# EAGLE board imix (EAGLE 7.5.0), part 1 of 2
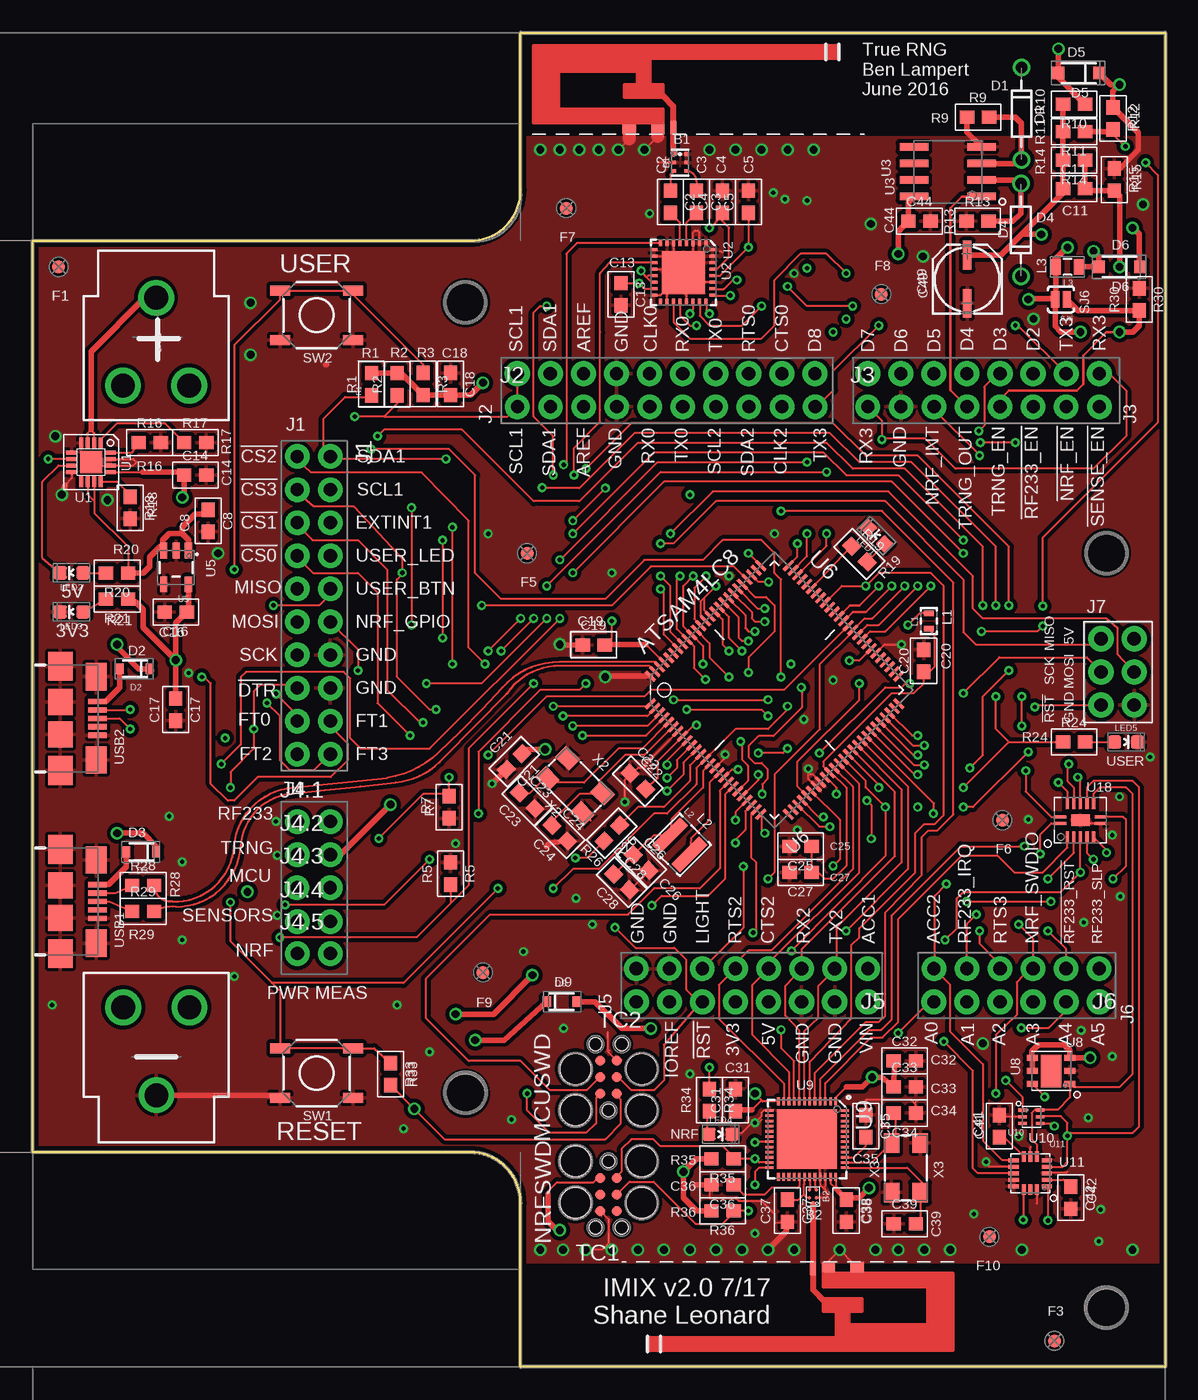
[diagram p8: board, top side]
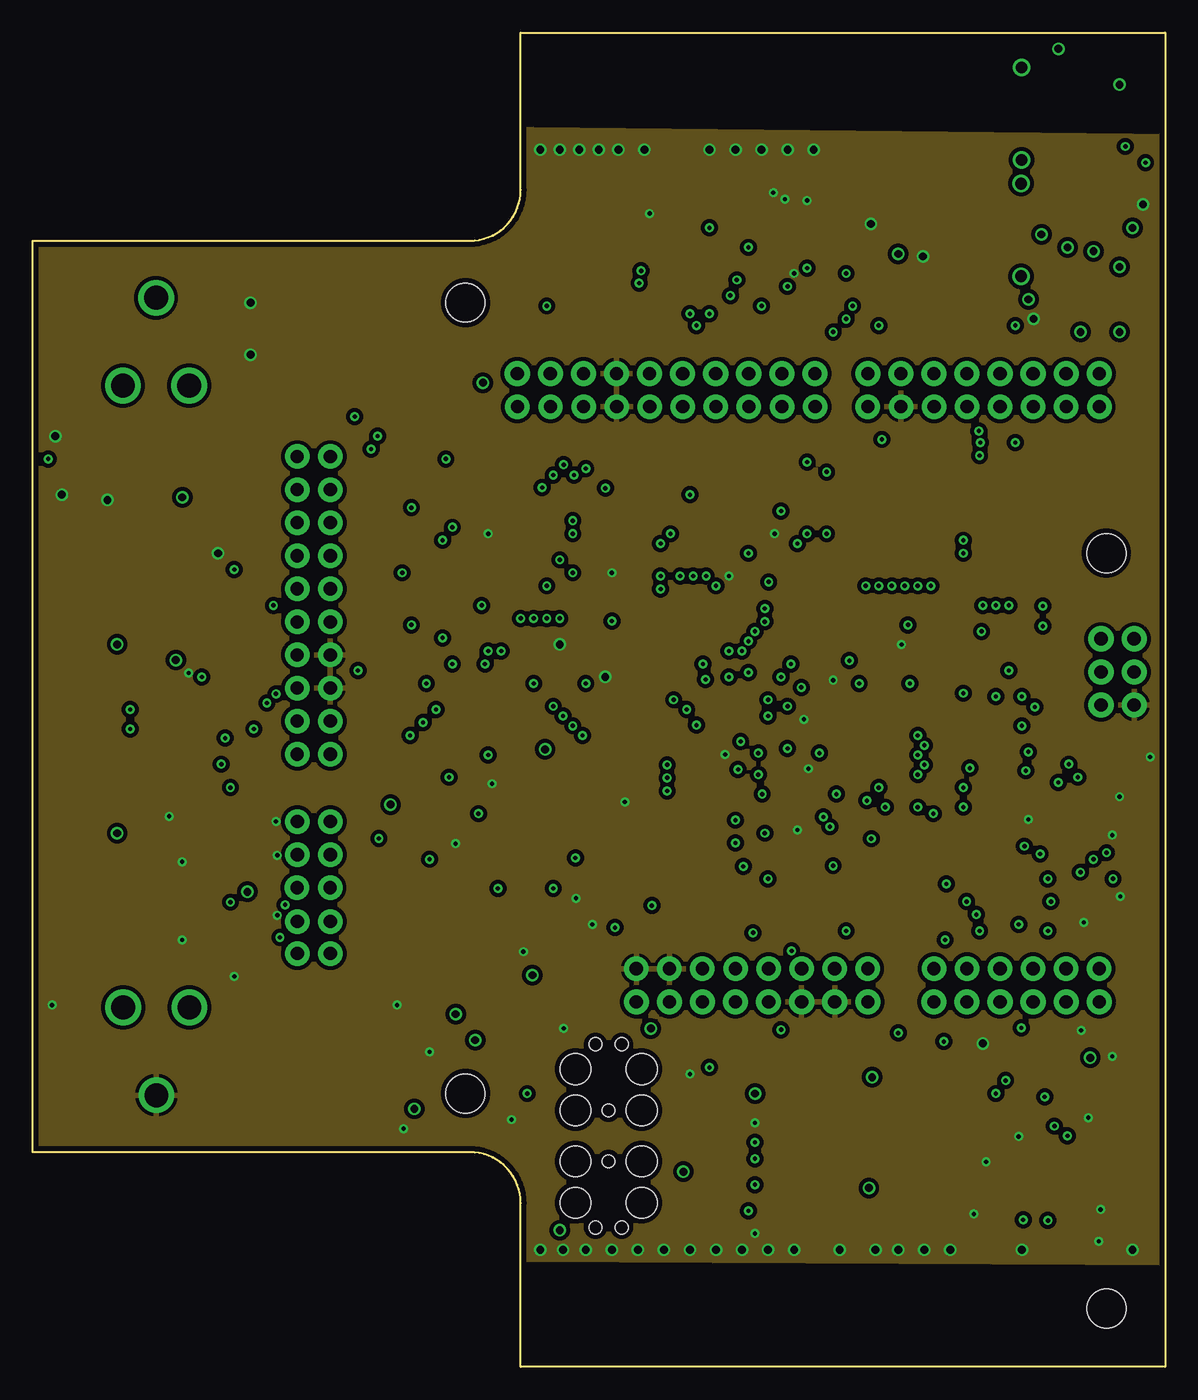
[diagram p9: board, inner layer Route2]
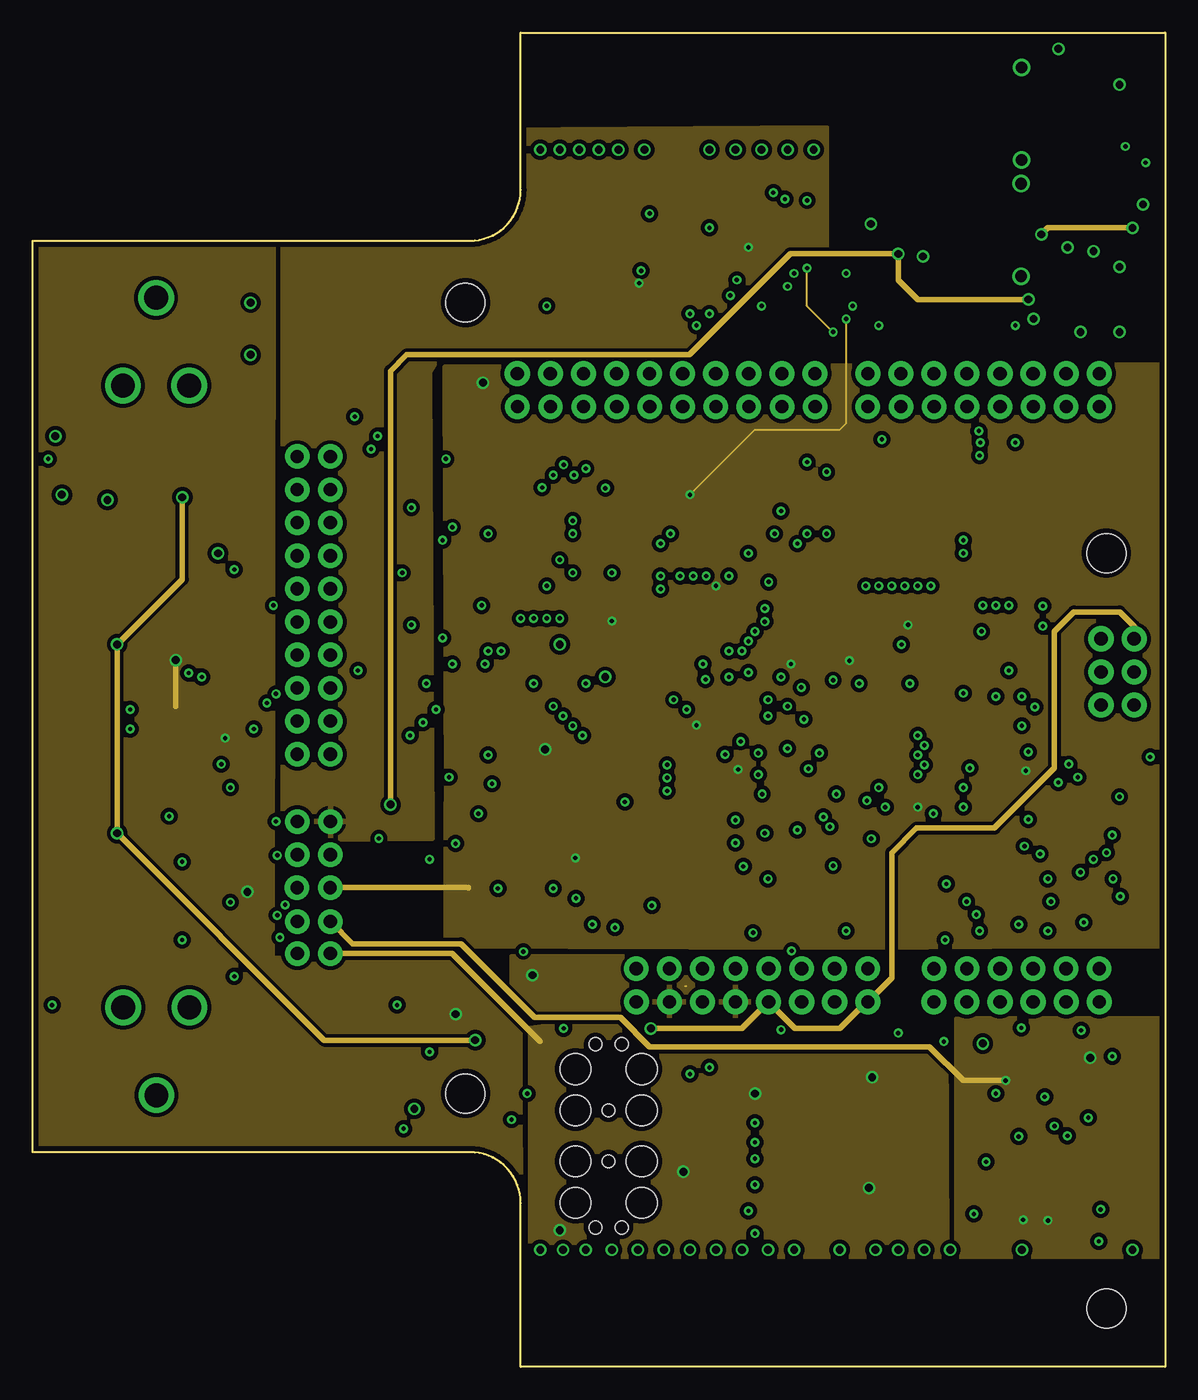
[diagram p10: board, inner layer Route15]
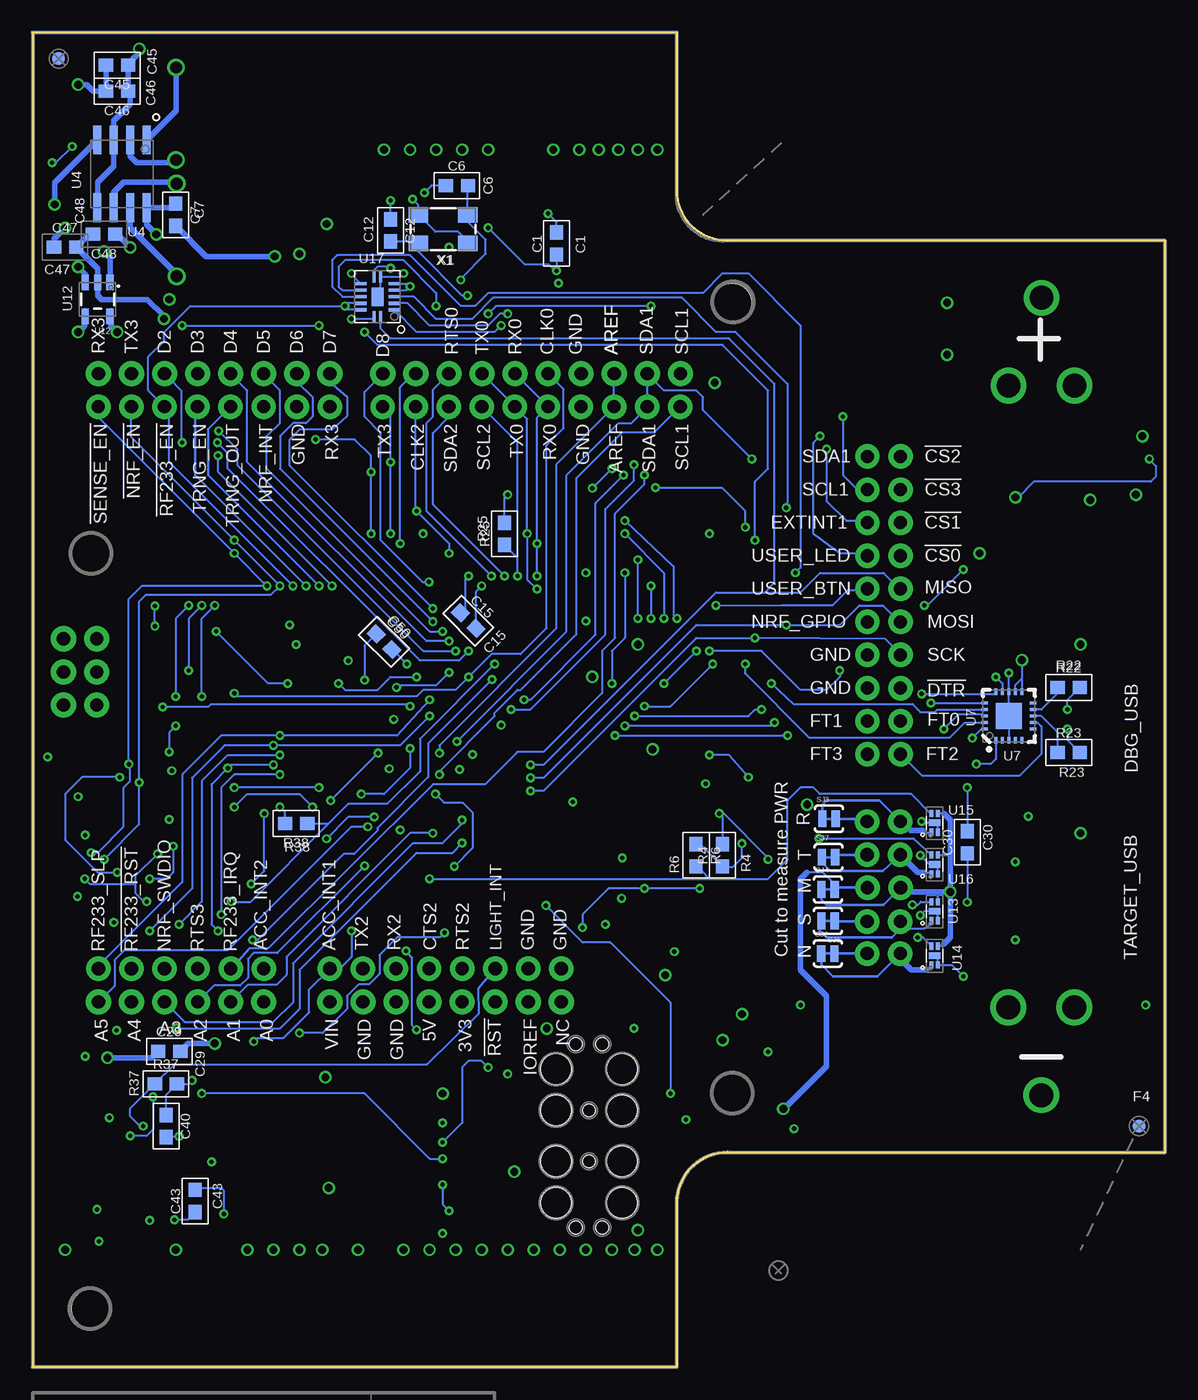
[diagram p11: board, bottom side, seen from below]

Size 87 x 102.5 mm. Coordinates in mm from the lower left corner, seen from the top.
Outline: 0,16.5 0,86.5 33.59,86.5 arc90 37.5,90.41 37.5,102.5 87,102.5 87,0 37.5,0 37.5,12.6 arc90 33.59,16.5 0,16.5
Copper layers (1+2*15+16): Top 0.0356mm / dielectric 9mil / Route2 0.0356mm / dielectric 40mil / Route15 0.0356mm / dielectric 9mil / Bottom 0.0356mm
Design rules "oshpark-2layer *": minimum track width 6mil, minimum drill 13mil, track to track 6mil, track to pad 6mil, pad to pad 6mil, via to via 6mil, smd to smd 6mil, copper to edge 15mil, drill to drill 6mil, minimum pad ring 7mil, minimum via ring 7mil, stop-mask expansion 2.5mil, vias tented up to drill 13mil, thermal gap 10mil
Net classes: 0 default: width 0.152 mm, drill 0.33 mm, clearance 0.152 mm; 1 power: width 0.152 mm, drill 0.33 mm, clearance 0.254 mm; 2 50ohm: width 0.152 mm, drill 0.33 mm, clearance 0.254 mm
Holes 3 mm at 33.25,81.75 33.25,21 82.5,4.5 82.5,62.5

## Footprints (pad centres in the part's own frame; a part is rotated, then mirrored left to right if it is on the bottom)
BALUN0805 = smd 0.3 x 0.3: 1 1.65,1.1; 2 1,1.1; 3 0.35,1.1; 4 0.35,0.15; 5 1,0.15; 6 1.65,0.15
BAL_NRF01D3 = smd 0.264 x 0.264: DIFF@1 0.219,0.25; DIFF@2 0.219,0.75; GND 0.819,0.75; SE 1.252,0.5; VCC 0.819,0.25
BATTERY_18650-HOLDER = drill 1.829: GND@1 30.628,0.01; GND@2 23.88,2.55; GND@3 23.88,-2.53; PWR@1 -30.628,-0.01; PWR@2 -23.88,2.53; PWR@3 -23.88,-2.55
C0603 = smd 1.1 x 1: 1 -0.85,0; 2 0.85,0
C0603-NOSILK = smd 1.1 x 1: 1 -0.85,0; 2 0.85,0
PANASONIC_C = smd 2.2 x 0.65: + 1.9,-0.2; - -1.8,-0.2
DIODE-ZENER = drill 0.9: P$1 -3.556,0; P$2 3.556,0
SOD-323 = smd 0.63 x 0.83: A 1.15,0; C -1.15,0
SOD-123 = smd 0.9 x 0.95: A 1.575,0; C -1.575,0
FIDUCIAL = smd 1 x 1: P$1 0,0
2X10_ROUND_NOSILK = drill 1.016 pad 1.88: 1 -11.43,-1.27; 2 -11.43,1.27; 3 -8.89,-1.27; 4 -8.89,1.27; 5 -6.35,-1.27; 6 -6.35,1.27; 7 -3.81,-1.27; 8 -3.81,1.27; 9 -1.27,-1.27; 10 -1.27,1.27; 11 1.27,-1.27; 12 1.27,1.27; 13 3.81,-1.27; 14 3.81,1.27; 15 6.35,-1.27; 16 6.35,1.27; 17 8.89,-1.27; 18 8.89,1.27; 19 11.43,-1.27; 20 11.43,1.27
1X10_NO_SILK = drill 1.016 pad 1.88: 1 0,0; 2 2.54,0; 3 5.08,0; 4 7.62,0; 5 10.16,0; 6 12.7,0; 7 15.24,0; 8 17.78,0; 9 20.32,0; 10 22.86,0
ARDUINO_R3_NO_HOLES = drill 1.016 pad 1.93: 3.3V 35.56,2.54; 5V 38.1,2.54; A0 50.8,2.54; A1 53.34,2.54; A2 55.88,2.54; A3 58.42,2.54; A4 60.96,2.54; A5 63.5,2.54; AREF 23.876,50.8; D0 63.5,50.8; D1 60.96,50.8; D2 58.42,50.8; D3 55.88,50.8; D4 53.34,50.8; D5 50.8,50.8; D6 48.26,50.8; D7 45.72,50.8; D8 41.656,50.8; D9 39.116,50.8; D10 36.576,50.8; D11 34.036,50.8; D12 31.496,50.8; D13 28.956,50.8; GND@1 40.64,2.54; GND@2 43.18,2.54; GND@3 26.416,50.8; GND@4 66.18,25.35; IOREF 30.48,2.54; MISO 63.64,30.43; MOSI 66.18,27.89; NC 27.94,2.54; RESET@1 33.02,2.54; RESET@2 63.64,25.35; SCK 63.64,27.89; SCL 18.796,50.8; SDA 21.336,50.8; VCC 66.18,30.43; VIN 45.72,2.54
1X08_NO_SILK = drill 1.016 pad 1.88: 1 0,0; 2 2.54,0; 3 5.08,0; 4 7.62,0; 5 10.16,0; 6 12.7,0; 7 15.24,0; 8 17.78,0
1X02_NO_SILK = drill 1.016 pad 1.88: 1 0,0; 2 2.54,0
1X06_NO_SILK = drill 1.016 pad 1.88: 1 0,0; 2 2.54,0; 3 5.08,0; 4 7.62,0; 5 10.16,0; 6 12.7,0
L0603 = smd 0.4 x 0.8: 1 0.2,0.4; 2 1.4,0.4
L1212 = smd 0.9 x 3: 1 -1.05,0; 2 1.05,0
0805 = smd 0.8 x 1.2: 1 -0.9,0; 2 0.9,0
LED-0603 = smd 1 x 1: A 0,-0.877; C 0,0.877
0603-RES = smd 1.1 x 1: 1 -0.85,0; 2 0.85,0
PAD-JUMPER-2-NC_BY_TRACE_YES_SILK = smd 0.635 x 1.27: 1 -0.508,0; 2 0.508,0
SJ_2S-NO = smd 0.635 x 1.27: 1 -0.45,0; 2 0.45,0
TACTILE-SWITCH-SMD = smd 1.524 x 0.762: 1 -2.794,1.905; 2 2.794,1.905; 3 -2.794,-1.905; 4 2.794,-1.905
TC2030-IDC = smd 0.787 x 0.787: 1 -1.27,-0.635; 2 -1.27,0.635; 3 0,-0.635; 4 0,0.635; 5 1.27,-0.635; 6 1.27,0.635 | hole 0.991: -2.54,0; 2.54,1.016; 2.54,-1.016 | hole 2.375: -2.54,2.54; -2.54,-2.54; 0.635,2.54; 0.635,-2.54
QFP16_3X3 = smd 0.85 x 0.3: 1 -1.475,0.75; 2 -1.475,0.25; 3 -1.475,-0.25; 4 -1.475,-0.75; 9 1.475,-0.75; 10 1.475,-0.25; 11 1.475,0.25; 12 1.475,0.75 | smd 0.3 x 0.85: 5 -0.75,-1.475; 6 -0.25,-1.475; 7 0.25,-1.475; 8 0.75,-1.475; 13 0.75,1.475; 14 0.25,1.475; 15 -0.25,1.475; 16 -0.75,1.475 | smd 1.7 x 1.7: PAD 0,0
32QN2 = smd 0.5 x 0.23: 1 -2.25,1.75; 2 -2.25,1.25; 3 -2.25,0.75; 4 -2.25,0.25; 5 -2.25,-0.25; 6 -2.25,-0.75; 7 -2.25,-1.25; 8 -2.25,-1.75; 17 2.25,-1.75; 18 2.25,-1.25; 19 2.25,-0.75; 20 2.25,-0.25; 21 2.25,0.25; 22 2.25,0.75; 23 2.25,1.25; 24 2.25,1.75 | smd 0.23 x 0.5: 9 -1.75,-2.25; 10 -1.25,-2.25; 11 -0.75,-2.25; 12 -0.25,-2.25; 13 0.25,-2.25; 14 0.75,-2.25; 15 1.25,-2.25; 16 1.75,-2.25; 25 1.75,2.25; 26 1.25,2.25; 27 0.75,2.25; 28 0.25,2.25; 29 -0.25,2.25; 30 -0.75,2.25; 31 -1.25,2.25; 32 -1.75,2.25 | smd 3.3 x 3.3: PADDLE 0,0
SO8 = smd 0.6 x 2.2: 1 -1.905,-2.6; 2 -0.635,-2.6; 3 0.635,-2.6; 4 1.905,-2.6; 5 1.905,2.6; 6 0.635,2.6; 7 -0.635,2.6; 8 -1.905,2.6
SOT23-5 = smd 0.55 x 1.2: 1 -0.95,-1.3; 2 0,-1.3; 3 0.95,-1.3; 4 0.95,1.3; 5 -0.95,1.3
TQFP100 = smd 1 x 0.25: 1 -7.5,6; 2 -7.5,5.5; 3 -7.5,5; 4 -7.5,4.5; 5 -7.5,4; 6 -7.5,3.5; 7 -7.5,3; 8 -7.5,2.5; 9 -7.5,2; 10 -7.5,1.5; 11 -7.5,1; 12 -7.5,0.5; 13 -7.5,0; 14 -7.5,-0.5; 15 -7.5,-1; 16 -7.5,-1.5; 17 -7.5,-2; 18 -7.5,-2.5; 19 -7.5,-3; 20 -7.5,-3.5; 21 -7.5,-4; 22 -7.5,-4.5; 23 -7.5,-5; 24 -7.5,-5.5; 25 -7.5,-6; 51 7.5,-6; 52 7.5,-5.5; 53 7.5,-5; 54 7.5,-4.5; 55 7.5,-4; 56 7.5,-3.5; 57 7.5,-3; 58 7.5,-2.5; 59 7.5,-2; 60 7.5,-1.5; 61 7.5,-1; 62 7.5,-0.5; 63 7.5,0; 64 7.5,0.5; 65 7.5,1; 66 7.5,1.5; 67 7.5,2; 68 7.5,2.5; 69 7.5,3; 70 7.5,3.5; 71 7.5,4; 72 7.5,4.5; 73 7.5,5; 74 7.5,5.5; 75 7.5,6 | smd 0.25 x 1: 26 -6,-7.5; 27 -5.5,-7.5; 28 -5,-7.5; 29 -4.5,-7.5; 30 -4,-7.5; 31 -3.5,-7.5; 32 -3,-7.5; 33 -2.5,-7.5; 34 -2,-7.5; 35 -1.5,-7.5; 36 -1,-7.5; 37 -0.5,-7.5; 38 0,-7.5; 39 0.5,-7.5; 40 1,-7.5; 41 1.5,-7.5; 42 2,-7.5; 43 2.5,-7.5; 44 3,-7.5; 45 3.5,-7.5; 46 4,-7.5; 47 4.5,-7.5; 48 5,-7.5; 49 5.5,-7.5; 50 6,-7.5; 76 6,7.5; 77 5.5,7.5; 78 5,7.5; 79 4.5,7.5; 80 4,7.5; 81 3.5,7.5; 82 3,7.5; 83 2.5,7.5; 84 2,7.5; 85 1.5,7.5; 86 1,7.5; 87 0.5,7.5; 88 0,7.5; 89 -0.5,7.5; 90 -1,7.5; 91 -1.5,7.5; 92 -2,7.5; 93 -2.5,7.5; 94 -3,7.5; 95 -3.5,7.5; 96 -4,7.5; 97 -4.5,7.5; 98 -5,7.5; 99 -5.5,7.5; 100 -6,7.5
QFN20 = smd 0.5 x 0.25: 1 -1.85,1; 2 -1.85,0.5; 3 -1.85,0; 4 -1.85,-0.5; 5 -1.85,-1; 11 1.85,-1; 12 1.85,-0.5; 13 1.85,0; 14 1.85,0.5; 15 1.85,1 | smd 0.25 x 0.5: 6 -1,-1.85; 7 -0.5,-1.85; 8 0,-1.85; 9 0.5,-1.85; 10 1,-1.85; 16 1,1.85; 17 0.5,1.85; 18 0,1.85; 19 -0.5,1.85; 20 -1,1.85 | smd 2 x 2: PADDLE 0,0
SI7021 = smd 0.85 x 0.45: 1 -1.45,1; 2 -1.45,0; 3 -1.45,-1; 4 1.45,-1; 5 1.45,0; 6 1.45,1 | smd 1.6 x 2.5: P$7 0,0
QFN48_6X6 = smd 0.6 x 0.2: 1 -2.9,2.2; 2 -2.9,1.8; 3 -2.9,1.4; 4 -2.9,1; 5 -2.9,0.6; 6 -2.9,0.2; 7 -2.9,-0.2; 8 -2.9,-0.6; 9 -2.9,-1; 10 -2.9,-1.4; 11 -2.9,-1.8; 12 -2.9,-2.2; 25 2.9,-2.2; 26 2.9,-1.8; 27 2.9,-1.4; 28 2.9,-1; 29 2.9,-0.6; 30 2.9,-0.2; 31 2.9,0.2; 32 2.9,0.6; 33 2.9,1; 34 2.9,1.4; 35 2.9,1.8; 36 2.9,2.2 | smd 0.2 x 0.6: 13 -2.2,-2.9; 14 -1.8,-2.9; 15 -1.4,-2.9; 16 -1,-2.9; 17 -0.6,-2.9; 18 -0.2,-2.9; 19 0.2,-2.9; 20 0.6,-2.9; 21 1,-2.9; 22 1.4,-2.9; 23 1.8,-2.9; 24 2.2,-2.9; 37 2.2,2.9; 38 1.8,2.9; 39 1.4,2.9; 40 1,2.9; 41 0.6,2.9; 42 0.2,2.9; 43 -0.2,2.9; 44 -0.6,2.9; 45 -1,2.9; 46 -1.4,2.9; 47 -1.8,2.9; 48 -2.2,2.9 | smd 4.6 x 4.6: PADDLE 0,0
ISL29035 = smd 0.65 x 0.25: 1 -0.675,0.5; 2 -0.675,0; 3 -0.675,-0.5; 4 0.675,-0.5; 5 0.675,0; 6 0.675,0.5
QFN16_3,5 = smd 0.8 x 0.3: 1 -1.275,1; 2 -1.275,0.5; 3 -1.275,0; 4 -1.275,-0.5; 5 -1.275,-1; 9 1.275,-1; 10 1.275,-0.5; 11 1.275,0; 12 1.275,0.5; 13 1.275,1 | smd 0.3 x 0.8: 6 -0.5,-1.275; 7 0,-1.275; 8 0.5,-1.275; 14 0.5,1.275; 15 0,1.275; 16 -0.5,1.275
TDFN4 = smd 0.3 x 0.55: 1 0.25,0.725; 2 -0.25,0.725; 3 -0.25,-0.725; 4 0.25,-0.725 | smd 0.86 x 0.5: PADDLE 0,0
DHVQFN14 = smd 0.9 x 0.24: 1 -1.55,-0.25; 7 1.55,-0.25; 8 1.55,0.25; 14 -1.55,0.25 | smd 0.24 x 0.9: 2 -1,-1.3; 3 -0.5,-1.3; 4 0,-1.3; 5 0.5,-1.3; 6 1,-1.3; 9 1,1.3; 10 0.5,1.3; 11 0,1.3; 12 -0.5,1.3; 13 -1,1.3 | smd 1.4 x 0.9: PADDLE 0,0
DN007-2 = smd 0.46 x 1: FEED 2.22,-2.8 | smd 1.01 x 0.74: GND -1.16,-2.93; GND@1 1.035,-2.93
USB-AB-MICRO-SMD = smd 1.4 x 0.4: D+ 2.85,0; D- 2.85,0.65; GND 2.85,-1.3; ID 2.85,-0.65; VBUS 2.85,1.3 | smd 1.9 x 2.2: SHIELD1 0,4; SHIELD4 0,-4 | smd 1.9 x 2: SHIELD2 0,1.25; SHIELD3 0,-1.25 | smd 1.6 x 2.1: SHIELD5 2.75,3.2; SHIELD6 2.75,-3.2
CTS_405_SERIES = smd 1.5 x 1.2: 1 -1.9,-1.1; 3 1.9,1.1; CASE@2 -1.9,1.1; CASE@4 1.9,-1.1

## Placement (x,y rotation side)
B1  2450BM15A0015  [BALUN0805]  50.37,91.52 90 top
B2  BAL_NRF01D3  [BAL_NRF01D3]  59.45,13.82 270 top
BAT1  [BATTERY_18650-HOLDER]  9.5,51.5 270 top
C1  100nF  [C0603]  46.73,86.29 90 bottom
C2  22pF  [C0603]  49,89.5 270 top
C3  22pF  [C0603]  51,89.5 270 top
C4  100nF  [C0603]  53,89.5 90 top
C5  1uF  [C0603]  55,89.5 90 top
C6  13pF  [C0603]  54.4,90.75 0 bottom
C7  0.47uF  [C0603]  76,88.5 270 bottom
C8  4.7uF  [C0603]  13.5,65 270 top
C11  22pF  [C0603]  80,90.5 0 top
C12  13pF  [C0603]  59.5,87.3 270 bottom
C13  1uF  [C0603]  45.2,82.4 270 top
C14  1uF  [C0603]  12.5,68.5 0 top
C15  100nF  [C0603]  53.53,57.33 315 bottom
C16  1uF  [C0603]  11,58 180 top
C17  100nF  [C0603]  11,50.5 270 top
C18  10uF  [C0603]  32.1,75.5 270 top
C19  100nF  [C0603]  43.1,55.47 0 top
C20  100nF  [C0603]  68.45,54.25 90 top
C21  100nF  [C0603]  37,46.5 225 top
C22  100nF  [C0603]  46.5,45 315 top
C23  13pF  [C0603]  38,43.5 315 top
C24  13pF  [C0603]  40.5,41 315 top
C25  4.7uF  [C0603]  59,40 180 top
C26  6.8uF  [C0603]  46.75,38.75 315 top
C27  100nF  [C0603]  59,38 180 top
C28  100nF  [C0603]  45.25,37.25 315 top
C29  100nF  [C0603]  76.5,24.25 0 bottom
C30  1uF  [C0603]  15.2,40.3 90 bottom
C31  100 nF  [C0603]  54,20.5 90 top
C32  100 nF  [C0603]  67,23.5 0 top
C33  100nF  [C0603]  67,21.5 0 top
C34  13pF  [C0603]  67,19.5 180 top
C35  1 nF  [C0603]  64,18.5 270 top
C36  47 nF  [C0603]  53,14 180 top
C37  2.2 nF  [C0603]  58,12 270 top
C38  1 nF  [C0603]  62.5,12 270 top
C39  13pF  [C0603]  67,11 0 top
C40  100nF  [C0603]  76.75,18.5 270 bottom
C41  100nF  [C0603]  74.25,18.5 90 top
C42  100nF  [C0603]  79.75,13 270 top
C43  100nF  [C0603]  74.5,12.75 90 bottom
C44  0.47uF  [C0603]  68.12,88.01 0 top
C45  DNP  [C0603]  80.5,100 180 bottom
C46  0.47uF  [C0603]  80.5,98 180 bottom
C47  0.47uF  [C0603-NOSILK]  84.5,86 0 bottom
C48  4.7uF  [C0603-NOSILK]  81.5,87 180 bottom
C49  10uF  [PANASONIC_C]  71.6,83.5 90 top
C50  100nF  [C0603]  59.99,55.71 315 bottom
D1  DIODE-ZENERPTH  [DIODE-ZENER]  75.97,96.27 270 top
D2  250mA/100V  [SOD-323]  7.86,53.63 180 top
D3  250mA/100V  [SOD-323]  8.36,39.56 180 top
D4  DIODE-ZENERPTH  [DIODE-ZENER]  75.93,87.34 90 top
D5  MBR0530  [SOD-123]  80.36,99.39 180 top
D6  MBR0530  [SOD-123]  83.5,84.5 180 top
D9  250mA/100V  [SOD-323]  40.65,28.06 0 top
F1  FIDUCIAL  [FIDUCIAL]  2,84.5 0 top
F2  FIDUCIAL  [FIDUCIAL]  85,100.5 0 bottom
F3  FIDUCIAL  [FIDUCIAL]  78.5,2 0 top
F4  FIDUCIAL  [FIDUCIAL]  2,18.5 0 bottom
F5  FIDUCIAL  [FIDUCIAL]  38,62.5 0 top
F6  FIDUCIAL  [FIDUCIAL]  74.5,42 0 top
F7  FIDUCIAL  [FIDUCIAL]  41,89 0 top
F8  FIDUCIAL  [FIDUCIAL]  65.2,82.4 0 top
F9  FIDUCIAL  [FIDUCIAL]  34.6,30.3 0 top
F10  FIDUCIAL  [FIDUCIAL]  73.5,10 0 top
J1  [2X10_ROUND_NOSILK]  21.6,58.5 270 top
J2  [1X10_NO_SILK]  37.25,73.76 0 top
J2_3_5_AND_6  ARDUINO_R3NO_HOLES  [ARDUINO_R3_NO_HOLES]  18.44,25.5 0 top
J3  [1X08_NO_SILK]  64.17,73.76 0 top
J4.1  [1X02_NO_SILK]  20.34,41.9 0 top
J4.2  [1X02_NO_SILK]  20.34,39.34 0 top
J4.3  [1X02_NO_SILK]  20.32,36.82 0 top
J4.4  [1X02_NO_SILK]  20.34,34.22 0 top
J4.5  [1X02_NO_SILK]  20.34,31.76 0 top
J5  [1X08_NO_SILK]  64.16,30.59 180 top
J6  [1X06_NO_SILK]  81.94,30.59 180 top
L1  BLM18HE152SN1  [L0603]  69.25,56.5 90 top
L2  22uH LQH3NPN220MJ0  [L1212]  49.72,40.11 315 top
L3  10uH  [0805]  79.5,84.5 180 top
LED1  [LED-0603]  64.82,63.84 45 top
LED2  [LED-0603]  3,61 90 top
LED3  [LED-0603]  3,58 90 top
LED4  [LED-0603]  52.85,17.88 270 top
LED5  [LED-0603]  84,48 270 top
R1  4.7K  [0603-RES]  26.03,75.49 90 top
R2  4.7K  [0603-RES]  27.99,75.49 90 top
R3  100K  [0603-RES]  30,75.5 270 top
R4  10K  [0603-RES]  34,39.3 90 bottom
R5  10K  [0603-RES]  32.1,37.9 270 top
R6  10K  [0603-RES]  36.02,39.3 270 bottom
R7  10K  [0603-RES]  32,43 90 top
R9  10K  [0603-RES]  72.63,96 0 top
R10  10K  [0603-RES]  80,97 180 top
R11  DNP  [0603-RES]  80,94.9 180 top
R12  DNP  [0603-RES]  83,95.9 270 top
R13  10K  [0603-RES]  72.6,88 0 top
R14  2.2M  [0603-RES]  80,92.7 180 top
R15  160K  [0603-RES]  83.1,91.2 270 top
R16  10K  [0603-RES]  9,71 0 top
R17  10K  [0603-RES]  12.5,71 0 top
R18  DNP  [0603-RES]  7.5,66 270 top
R19  1K  [0603-RES]  63.52,62.44 315 top
R20  1K  [0603-RES]  6.5,61 180 top
R21  1K  [0603-RES]  6.5,59 180 top
R22  27  [0603-RES]  7.4,52.2 0 bottom
R23  27  [0603-RES]  7.4,47.2 0 bottom
R24  1K  [0603-RES]  80,48 0 top
R25  4.7K  [0603-RES]  50.75,64 90 bottom
R26  10K  [0603-RES]  44.5,41 225 top
R28  27  [0603-RES]  8.5,37 0 top
R29  27  [0603-RES]  8.5,35 0 top
R30  10K  [0603-RES]  85,82 270 top
R33  DNP  [0603-RES]  27.5,22.5 270 top
R34  1K  [0603-RES]  52,20.5 270 top
R35  10K  [0603-RES]  53,16 180 top
R36  10K  [0603-RES]  53,12 180 top
R37  4.7K  [0603-RES]  76.75,21.75 0 bottom
R38  4.7K  [0603-RES]  66.75,41.75 180 bottom
SJ1  [PAD-JUMPER-2-NC_BY_TRACE_YES_SILK]  25.9,34.26 180 bottom
SJ2  [PAD-JUMPER-2-NC_BY_TRACE_YES_SILK]  25.91,31.76 0 bottom
SJ3  [PAD-JUMPER-2-NC_BY_TRACE_YES_SILK]  25.82,42.11 0 bottom
SJ4  [PAD-JUMPER-2-NC_BY_TRACE_YES_SILK]  25.89,36.68 0 bottom
SJ6  SOLDERJUMPERNO  [SJ_2S-NO]  79,82 180 top
SJ7  [PAD-JUMPER-2-NC_BY_TRACE_YES_SILK]  25.85,39.15 0 bottom
SW1  TAC_SWITCHSMD  [TACTILE-SWITCH-SMD]  21.82,22.57 180 top
SW2  TAC_SWITCHSMD  [TACTILE-SWITCH-SMD]  21.82,80.78 180 top
TC1  TC2030-IDC  [TC2030-IDC]  44.25,13.25 270 top
TC2  TC2030-IDC  [TC2030-IDC]  44.25,22.25 90 top
U1  BQ2423X  [QFP16_3X3]  4.5,69.5 270 top
U2  [32QN2]  50,84.07 270 top
U3  TLV3202  [SO8]  70.31,91.81 90 top
U4  LM358  [SO8]  80.14,91.64 180 bottom
U5  LDO-TPS78233  [SOT23-5]  11.03,61.41 180 top
U6  ATSAM4LCX_100  [TQFP100]  57,52 45 top
U7  [QFN20]  12,50 90 bottom
U8  SI7021  [SI7021]  78.25,22.73 180 top
U9  NRF51422  [QFN48_6X6]  59.5,17.5 270 top
U10  ISL29035  [ISL29035]  76.73,19.22 0 top
U11  FX0S8700CQ  [QFN16_3,5]  76.64,14.88 180 top
U12  296-12686-1-ND  [SOT23-5]  82,82 180 bottom
U13  SIP32401A  [TDFN4]  17.7,35 180 bottom
U14  SIP32401A  [TDFN4]  17.7,31.6 180 bottom
U15  SIP32401A  [TDFN4]  17.7,41.8 180 bottom
U16  SIP32401A  [TDFN4]  17.7,38.6 180 bottom
U17  74LVC4066BQ  [DHVQFN14]  60.5,82.2 90 bottom
U18  74LVC4066BQ  [DHVQFN14]  80.5,42 0 top
U$1  INVERTED_F_ANTENNA-2  [DN007-2]  47,98 0 top
U$4  INVERTED_F_ANTENNA-2  [DN007-2]  62.18,4.76 180 top
USB1  [USB-AB-MICRO-SMD]  2.14,35.75 0 top
USB2  [USB-AB-MICRO-SMD]  2.14,49.82 0 top
X1  16MHz  [CTS_405_SERIES]  55.45,87.4 180 bottom
X2  16MHz  [CTS_405_SERIES]  41.66,44.64 135 top
X3  16MHz  [CTS_405_SERIES]  67.09,15.3 90 top

## Tracks (layer width: path | path; a pad name or v marks a point on that pad's centre or on a via)
!RESET  (via drill 0.33)
  Top 0.152: v40,36.75 41.5,38.25 43.5,38.25 47.75,42.5 48.75,42.5 51,44.75 51,46 U6.13 54,49 56.5,49 58,50.5 v58,50.75 | v35.75,36.75 28.5,29.5 18.4,29.5 | 18.4,29.5 15.2,32.7 v15.2,35.7 | TC2.3 45,22.25 46,21.25 47.75,21.25 48.5,22 48.5,24.75 51.25,28 51.42,28 J2_3_5_AND_6.RESET@1 51.16,28.04 50.2,29 50.2,31.3 49.3,32.2 46.3,32.2 v44.75,33.75 | 18.4,29.5 19.03,28.87 SW1.4 SW1.3 26.24,24.48 R33.1 | v77,50.7 77.15,50.85 J2_3_5_AND_6.RESET@2
  Bottom 0.152: v35.75,36.75 v40,36.75 42.75,36.75 44.75,34.75 v44.75,33.75 | v58,50.75 58.15,50.9 73.3,50.9 73.5,50.7 v77,50.7 | C30.1 v15.2,35.7
ACC_INT1  (via drill 0.33)
  Top 0.152: U6.42 67.25,44.58 67.25,38.25 v62.5,33.5 | U11.11 72.61,14.88 72.25,15.25 72.25,22.75 v70,25
  Bottom 0.152: v62.5,33.5 62.5,31.5 63.41,30.59 J5.1 65.75,29 65.75,27.25 67.75,25.25 69.75,25.25 v70,25
ACC_INT2  (via drill 0.33)
  Top 0.152: U6.43 69.24,43.3 69.24,42.54 v69.2,42.5 | U11.9 74.5,15.88 73,17.39 73,23.25 70.5,25.75 70.5,29.33 J6.6 69.3,30.65 69.3,36.2 v70.2,37.1
  Bottom 0.152: v69.2,42.5 69.2,38.1 v70.2,37.1
ADCIFE0  (via drill 0.33)
  Top 0.152: U6.24 55.2,42.42 55.2,39.15 55.55,38.8 55.55,33.55 v55.35,33.35 | v66.5,25.65 68.85,28 69.2,28 J2_3_5_AND_6.A0
  Bottom 0.152: v66.5,25.65 64.7,25.65 62.85,27.5 62.85,28.5 61.95,29.4 61.15,29.4 60.35,30.2 60.35,31.65 58.95,33.05 55.65,33.05 v55.35,33.35
ADCIFE1  (via drill 0.33)
  Top 0.152: U6.25 56,42.38 56,41.25 v56.25,41
  Bottom 0.152: v56.25,41 58,41 67.5,31.5 67.5,30.1 68.25,29.35 70.47,29.35 J2_3_5_AND_6.A1
ADCIFE2  (via drill 0.33)
  Top 0.152: U6.31 62,42.05 62,39 v61.5,38.5
  Bottom 0.152: v61.5,38.5 68.2,31.8 70,31.8 70.45,31.35 70.45,29.9 71.05,29.3 73.06,29.3 J2_3_5_AND_6.A2
ADCIFE3  (via drill 0.33)
  Top 0.152: U6.22 54,42.64 v54,42
  Bottom 0.152: v54,42 54,41.75 55.5,40.25 57.75,40.25 67,31 67,28 68.5,26.5 75.32,26.5 J2_3_5_AND_6.A3
ADCIFE4  (via drill 0.33)
  Top 0.152: U6.23 54.75,42.68 54.75,41.25 54,40.5 v54,40.25 | v75.95,26.05 78.05,26.05 79.4,27.4 J2_3_5_AND_6.A4
  Bottom 0.152: v54,40.25 54.75,39.5 57.5,39.5 66.5,30.5 66.5,27.5 68,26 75.87,26 75.92,26.05 v75.95,26.05
ADCIFE5  (via drill 0.33)
  Top 0.152: U6.28 60.43,41.5 v61.25,41.5
  Bottom 0.152: v61.25,41.5 62.5,41.5 72,32 79.95,32 80.7,31.25 80.7,29.28 J2_3_5_AND_6.A5
AREF  (via drill 0.33)
  Top 0.152: U6.34 60.97,45.28 61.75,44.5 v61.75,44 | v58,47.5 57.65,47.15 v55.75,47.15
  Bottom 0.152: v58,47.5 58,46 60,44 v61.75,44 | J2_3_5_AND_6.AREF 42.33,76.29 J2.3 46.75,69.34 46.75,56.75 55.75,47.75 v55.75,47.15
BUCK/BOOST
  Top 0.152: U6.12 50.5,46.21 50.5,45 48.5,43 46.5,43 R26.1
DTR  (via drill 0.33)
  Top 0.152: J1.15 20.08,52.4 17.5,52.4 17,51.9 v17,49 17,47.5 15.2,45.7 v15.2,44.5
  Bottom 0.152: U7.18 13.9,50 14,50.1 15.9,50.1 v17,49 | v15.2,44.5 C30.2
EXTINT1  (via drill 0.33)
  Top 0.152: U6.30 58.75,44.59 58.75,46.5 63.5,51.25 v63.5,52.5 | v57.5,53 57.5,60.5 57,61 57,62.5 56,63.5 53,63.5 51.5,62 47,62 44,59 36,59 34,61 34,68.5 32,70.5 v26,70.5
  Bottom 0.152: v63.5,52.5 63,52 60.5,52 59.5,53 v57.5,53 | v26,70.5 26,66.5 24.5,65 23.02,65 J1.6
FTDI0  (via drill 0.33)
  Top 0.152: v18.7,51.7 20.3,50.1 20.3,49.7 J1.17
  Bottom 0.152: v18.7,51.7 13.1,51.7 13,51.8 U7.15
FTDI1  (via drill 0.33)
  Top 0.152: J1.18 22.9,49.6 22.9,49.2 24.2,47.9 24.2,46.6 22.9,45.3 17.3,45.3 15.5,43.5 15,43.5 13.7,44.8 13.7,52.5 13.2,53 v13,53
  Bottom 0.152: v13,53 12.5,52.5 U7.14
FTDI2
  Bottom 0.152: 20.33,46.99 J1.19 18.66,45.4 11.2,45.4 9.5,47.1 9.5,49.2 9.8,49.5 U7.7
FTDI3  (via drill 0.33)
  Top 0.152: v18,51 19,50 19,46.6 19.8,45.8 21.6,45.8 J1.20
  Bottom 0.152: v18,51 U7.16
GND  (via drill 0.33, 0.6)
  Top 0.152: U6.56 65.45,55.5 v66.75,55.5 | 42.88,41.94 X2.CASE@2 | 44.06,53.06 v44,53 | U9.PADDLE 60.5,16.5 U9.33 60.5,14 60.75,13.75 | 60.75,13.75 61,13.5 61,13 B2.GND | U2.PADDLE 49.75,84.32 49.5,84.32 48.5,85.32 U2.10 | U2.16 48.25,82.32 U2.PADDLE | U2.18 48.75,83.25 49.5,84 49.18,84.32 | 48.75,84.75 49.18,84.32 | U2.27 50.75,83.32 50.53,83.53 | 50.53,83.53 U2.PADDLE | U2.21 50.25,83.82 U2.PADDLE | 50.53,83.53 50.75,83.75 U2.3 50.75,87.15 50.9,87.3 51.1,87.3 51.2,87.2 51.2,86.37 U2.2 | 4.25,69.75 U1.PAD 4.75,69.25 U1.14 7.75,69.25 8,69.5 7.75,69.75 U1.15 | U2.12 49.18,84.32 | v42.5,9 43.75,9 44.25,9.5 44.25,11.34 TC1.5 | LED4.C 53.84,18 54.5,18 55.5,19 v55.5,18.75 | v55.5,18.75 55.5,18.5 56,19 | 64,19.75 C35.1 64,20.5 67.5,20.5 67.85,20.15 C34.1 | C36.2 52,13.85 52,13 54,13 54.25,12.75 56,12.75 57,11.75 57,11 57.06,11.07 C37.2 | U$4.GND@1 60.97,7.96 v62,9 63.07,7.93 U$4.GND | U11.10 73.61,15.38 arc-90 v73.25,15.75 | 46,45.25 C22.1 | U6.7 47,46.24 47,46 46.5,46 45.5,45.1 v45.5,43.4 | v45,93.5 45.84,94.34 | v47,93.5 48.03,94.53 | C28.2 47.38,38.06 C26.2 | U2.PADDLE 50,84 49.25,84.75 U2.6 49.25,86.5 | 44.2,24.2 44.3,24.3 | TC2.5 44.2,24.2 | 44.2,24.2 44.2,25.7 | U9.34 60.9,13.9 60.75,13.75 | U9.13 56.2,19.7 56,19.5 56,19.25 v55.5,18.75 | 3,70.28 U1.5 | U1.8 3.02,68.28 2.5,67.75 | 67.85,20.35 68,20.5 | U2.31 52.42,85.32 | 52.8,85.7 52.9,85.7 53,85.6 | U6.33 59.96,45.5 59.65,45.5 59.6,45.45 | B1.2 48.02,92.52 | 79.5,15 79.4,14.9 77.9,14.9 | U10.2 74.38,19.22 C41.2 | U11.16 77.14,12.56 77.15,12.55 | U11.7 76.64,16.89 76.65,16.9 | U6.15 53.2,46.79 v53.2,47.05 | U6.32 59.6,45.16 59.6,45.45 | 59.6,45.45 v59.6,45.95 | 57.75,89.62 v57.8,89.7
  Top 0.152: U18.7 80.75,41.75 U18.PADDLE
  Top 0.406: U6.100 44.06,53.06 | C19.1 40.53,55.47 v40.5,55.5 | 2.5,67.75 v2.25,67 | C37.2 57.93,10.43 v56.5,9 | LED5.C 84.62,48.26 | C24.2 39.74,40.24 39.5,40 | C36.2 51,14 | 18.68,20.87 BAT1.GND@1 | 22.59,77 22.5,77 | R9.1 71.78,94.84 U3.4 | C21.2 v35.3,44.8 | 83.15,92.05 R15.1 83.5,92.05 84.95,93.5 84.95,94.8 R12.1 83,98 v83.5,98.5 82.83,98.5 D5.C
  Top 1: 45.84,94.34 U$1.GND | 48.03,94.53 U$1.GND@1
  Bottom 0.152: U7.3 U7.PADDLE U7.13 v12,53.3 | R6.1 35.62,40.07 R4.1 33.95,38.4 33.2,38.4 32.5,39.1 v32.5,40.2 | C43.2 74.35,13.75 72.5,13.75 72.31,13.56 v72.31,11.75 | C40.2 76.7,17.7 v75.75,17.7 | C15.1 53.75,58.31 53.75,60.5 v53.5,60.75 | C50.1 61.5,55.4 v61.5,52.75 | C12.1 v59.5,89.6 | X1.CASE@4 57.5,88.35 | X1.CASE@2 53.55,86.45 54.3,87.2 56.05,87.2 X1.CASE@4 | X1.CASE@4 57.35,89.25 v57.8,89.7 | C1.2 46.73,87.94 v47.4,88.6 | C6.1 56.35,90.75 v56.9,90.2 | v58.5,84 58.75,83.75 U17.7 60.25,82.45 U17.PADDLE | U15.2 17.45,41.8 U15.PADDLE 18.6,41.8 v18.7,41.9 | v18.8,39.3 18.1,38.6 U16.PADDLE 17.45,38.35 U16.2 | v18.8,34.7 18.5,35 U13.PADDLE 17.45,34.75 U13.2 | v15.5,30 16.38,30.88 U14.2 17.45,31.35 U14.PADDLE
  Bottom 0.406: C45.2 C46.2 82.35,98 82.85,98.5 v83.5,98.5 | U4.4 85.3,90.98 v85.3,89.3 | C7.2 73.65,85.3 v68.4,85.3 | C48.2 82.65,87 C47.2 82,84.35 U12.2 82,82.3 81.7,82 78.2,82 76.9,80.7 v76.9,80.5 | C29.2 75.05,24.85 v73,24.85
  other vias: 39,93.5 14.25,62.5 5.75,66.6 52,93.5 58,93.5 60,93.5 42,93.5 39,9 40.75,9 44.5,9 46.5,9 48.5,9 50.5,9 52.5,9 54.5,9 58.5,9 64.75,9 66.5,9 68.5,9 70.5,9 84.5,9 76,9 81.9,9.65 43,34 44.5,61 40.5,93.5 43.5,93.5 50.5,22.5 55.5,10.25 83.5,43.8 76.5,42.05 82.95,23.85 59.25,49.75 41.75,36 58.75,41.25 1.75,71.5 16.75,81.75 16.75,77.75 54,93.5 56,93.5 81.1,19.15 82.05,12.1 80.55,25.85 83.55,36.15 80.75,34.15 85.85,46.85 82.95,40.85 35,64 57,64 30.5,24.2 11.5,32.8 11.5,38.8 10.5,42.3 1.5,27.8 37.7,31.9 28.5,18.3 28,27.8 36.8,19 40.8,26 64.4,87.8
  pour Route2 (isolate 0.305): -4,95.5 -5,8.5 88,8 88,94.5
  pour Top (isolate 0.305): -12.5,94.5 95.8,94.5 95.5,8 -12.5,8
GPIO2  (via drill 0.33)
  Top 0.152: U6.86 53,57.41 53,55.5 v53.5,55 | v75.5,71 v72.8,71
  Bottom 0.152: J2_3_5_AND_6.D2 76.5,75.94 75.58,74.99 75.58,71.08 v75.5,71 | v53.5,55 54.25,54.25 57.25,54.25 72,69 72,70.2 v72.8,71
GPIO3  (via drill 0.33)
  Top 0.152: v54.5,55 53.5,56 53.5,57.62 U6.85 | J2_3_5_AND_6.D3 74.1,76.3 73.1,75.3 73.1,72.3 v72.7,71.9
  Bottom 0.152: v54.5,55 57,55 71.25,69.25 71.25,70.45 v72.7,71.9
GPIO4  (via drill 0.33)
  Top 0.152: v55,55.75 54.5,55.75 54.25,56 54.25,57.58 U6.84
  Bottom 0.152: J2_3_5_AND_6.D4 71.78,76.28 70.5,75 70.5,69.5 56.75,55.75 v55,55.75
GPIO5  (via drill 0.33)
  Top 0.152: U6.83 53.46,59.04 54.75,57.75 54.75,56.75 55,56.5 v55.5,56.5
  Bottom 0.152: J2_3_5_AND_6.D5 69.24,76.24 68,75 68,72.5 69,71.5 69,69 56.5,56.5 v55.5,56.5
GPIO6  (via drill 0.33)
  Top 0.152: 56,57.24 v56.25,57.25 55.5,57.25 55.25,57.5 55.25,57.99 U6.82
  Bottom 0.152: J2_3_5_AND_6.D6 66.7,75.7 65.5,74.5 65.5,73 66,72.5 67,72.5 68,71.5 68,69 v56.25,57.25
GPIO7  (via drill 0.33)
  Top 0.152: U6.81 55.7,58.25 v56.25,58.25
  Bottom 0.152: J2_3_5_AND_6.D7 64.16,75.66 62.85,74.53 62.85,73.03 64,72 66.5,72 67.25,71.25 67.25,69.25 v56.25,58.25
GPIO8  (via drill 0.33)
  Top 0.152: v56.55,60.3 55.77,60.3 U6.78
  Bottom 0.152: J2_3_5_AND_6.D8 61.5,74.9 61.5,73 60.25,71.75 60.25,63.5 57.05,60.3 v56.55,60.3
KERNEL_LED
  Top 0.152: U6.70 R19.1
LIGHT_!INT  (via drill 0.33)
  Top 0.152: U10.4 78.28,18.72 v78.5,18.5 | U6.80 55.51,59.15 56.35,59.15 57,58.5 57,56.5 55,54.5 v55,53.35 | v56.05,44 56.05,44.75 56.45,45.15 56.45,45.95 56,46.4 55.45,46.4 55,46.85 55,47.7 55.75,48.45 56.9,48.45 59.1,50.65 59.1,52.15 v59.05,52.2 | v54.6,38.45 54.6,33.73 J5.6
  Bottom 0.152: J5.6 52.72,29.08 52.71,27.16 56.7,23.25 76.1,23.25 R37.1 79.5,19.85 79.5,19.25 78.75,18.5 v78.5,18.5 | v55,53.35 55.95,52.4 58.85,52.4 v59.05,52.2 | v56.05,44 55.4,43.35 53.95,43.35 53.2,42.6 53.2,39.85 v54.6,38.45
MCU_VOUT3.3
  Top 0.152: U6.16 52,44.88 52,42 50.58,40.58 L2.2
MISO  (via drill 0.33)
  Top 0.152: U6.9 48.75,46.58 v48.75,46.25
  Bottom 0.152: v48.75,46.25 47.75,46.25 34.5,59.5 30.75,59.5 | 30.75,59.5 28,59.5 26.5,61 21.64,61 20.41,59.77 J1.9 | 30.75,59.5 30,60.25 30,75.5 33.5,79 59.5,79 60.25,79.75 U17.1
MOSI  (via drill 0.33)
  Top 0.152: v29.1,66 v29.1,57 | U6.10 49.5,46.62 49.5,46 v48.75,45.25
  Bottom 0.152: v48.75,45.25 47.75,45.25 36,57 v29.1,57 25,57 23.5,58.5 21.68,58.5 20.41,57.23 J1.11 | U17.4 57.7,82.2 56,80.5 53.25,80.5 51.62,82.12 37.12,82.12 34.5,79.5 33,79.5 29,75.5 29,66.1 v29.1,66
N$1
  Top 0.152: U2.5 49.75,87.9 C2.2
N$2  (via drill 0.33)
  Top 0.152: U2.29 52.57,84.32 53.5,85.25 53.5,87.5 53,88 C4.1 52.15,87.5 v52,87.5 | U2.14 47.53,83.32 47.18,83.72 | 47.18,83.72 v46.75,84.2 | U2.13 47.29,83.82 47.18,83.72
  Bottom 0.152: C1.1 46.75,85.42 v46.75,84.2 47.35,84.7 49.2,84.7 v52,87.5
N$3
  Top 0.152: USB1.D- 6.38,36.4 R28.1
N$4  (via drill 0.33)
  Top 0.152: U2.26 52.27,82.8 53.1,82.8 53.8,83.5 v54.1,83.5
  Bottom 0.152: v54.1,83.5 54.1,83.6 52.2,85.5 52.2,86.6 53.5,87.9 53.5,88.45 X1.1 53.6,88.5 53.6,90.15 C6.2
N$5
  Top 0.152: 59.95,7.97 U$4.FEED | 59.95,12.5 B2.SE
  Top 0.46: 59.95,12.5 U$4.FEED
N$6
  Top 0.152: B2.VCC 59.5,13 59.25,13.25 | 59.25,13.25 59.25,14 59.3,14.05 U9.30 | C37.1 58.85,12.85 59.25,13.25
N$7
  Top 0.152: U9.38 64.49,15.7 X3.3 66.29,17.5 66.29,19.36 C34.2
N$8
  Bottom 0.152: U13.1 17.95,34.05 18.5,33.7 19.82,33.7 J4.4.1
  Bottom 0.203: J4.4.1 20.34,33.66 21,33 26,33 26.5,33.5 26.5,34.26 SJ1.2
N$9
  Top 0.152: U9.37 67.2,15.3 68.5,14 68.5,13.71 X3.1 68.19,11.34 C39.2
N$10
  Top 0.152: C25.1 C27.1 60.35,38 60.85,37.5 61.5,37.5 62.5,38.5 62.5,44.5 61.36,45.64 U6.35 60.75,46.13 60.75,46.5 66,51.75 67.7,51.75 68.45,52.5 C20.1 68.9,53.4 69.3,53.8 69.3,56.2 L1.1
N$11
  Top 0.152: U6.6 49.17,49.17 47,47 45.5,47 43.5,45 43.5,43.95 | 43.5,43.95 X2.1 | 43.5,43.95 43.45,44 42,44 39.95,41.95 C24.1
N$12
  Top 0.152: U6.14 51.5,45.79 51.5,44.5 49.09,42.09 L2.1 | C28.1 46.17,39.26 C26.1 47.75,40.85 L2.1 | 48.25,40.85 L2.1
N$13
  Top 0.152: U6.5 46.84,47.5 45,47.5 42.38,44.88 39.87,44.88 X2.3 39.33,45.21 38.23,44.1 C23.1
N$14
  Top 0.152: R19.2 LED1.A
N$15
  Top 0.152: U9.39 63.1,16.1 64,17 C35.2
N$17
  Top 0.152: U2.4 50.25,87.9 C3.2
N$18
  Bottom 0.152: 18.32,30.5 U14.1
  Bottom 0.203: J4.5.1 22.1,30 25.5,30 26.42,30.92 SJ2.1
  Bottom 0.406: J4.5.1 20.34,31.34 19.5,30.5 18.32,30.5
N$19
  Top 0.152: U9.29 58.9,13.9 58.75,13.75 56.75,13.75 56.25,13.25 54.6,13.25 C36.1 53.5,13.62
N$20  (via drill 0.33)
  Top 0.152: USB2.D- 7.47,50.47 v7.5,50.5
  Bottom 0.152: v7.5,50.5 7.5,51.25 R22.2
N$21
  Top 0.152: U9.31 B2.DIFF@1
N$22
  Top 0.152: B1.3 49,91.6 C2.1
N$23
  Top 0.152: U9.32 60.1,13.7 B2.DIFF@2
N$24
  Bottom 0.152: R22.1 8.25,51.75 9.5,50.5 U7.9
N$26  (via drill 0.33)
  Top 0.152: USB2.D+ 6.68,49.82 v7.5,49
  Bottom 0.152: v7.5,49 7.5,48.15 R23.2
N$29
  Top 0.152: R24.2 LED5.A
N$30
  Bottom 0.152: R23.1 8.25,48.75 9.5,50 U7.8
N$32
  Bottom 0.152: 18.5,38 18.07,38 U16.1 | 25.7,38.1 26.36,38.76 SJ7.1
  Bottom 0.203: J4.2.1 21.68,38.1 25.7,38.1 | 26.36,38.86 SJ7.1
  Bottom 0.406: J4.2.1 19,38 18.5,38
N$33
  Bottom 0.152: 18.6,41.2 18.43,41.08 U15.1
  Bottom 0.203: J4.1.1 21.94,43.5 26,43.5 26.33,43.17 SJ3.1
  Bottom 0.406: J4.1.1 19.54,41.2 18.6,41.2
N$34
  Top 0.152: USB1.D+ 5.87,35.75 R29.1
N$38
  Top 0.152: LED3.A R21.2
N$40  (via drill 0.33)
  Top 0.152: U2.25 52.27,82.3 v53.6,82.3
  Bottom 0.152: 57.35,86.05 X1.3 | v53.6,82.3 54,82.3 57.35,85.65 X1.3 | X1.3 57.6,86.45 C12.2
N$41
  Top 0.152: C3.1 51,91.09 arc90 B1.4
N$42
  Top 0.47: B1.1 49.22,93.22 U$1.FEED
N$43  (via drill 0.6)
  Top 0.406: L3.1 D6.A 81.92,85.28 v81.5,85.7
  Bottom 0.406: U12.1 81.05,85.25 v81.5,85.7
N$46  (via drill 0.6)
  Top 0.406: R14.1 C11.2 81,90.35 R15.2 83.5,89.95 v83.5,84.5
  Bottom 0.406: U12.3 82.95,83.95 v83.5,84.5
N$47
  Top 0.152: LED2.C 0.75,62.15 0.75,68 2,69.25 U1.7
N$49
  Top 0.152: LED2.A R20.2
N$51
  Bottom 0.406: U4.1 75.97,96.5 D1.P$1
N$52
  Bottom 0.406: U4.7 79.5,87.5 75.93,83.93 D4.P$1 76,83.85
N$53
  Top 0.152: 11.38,70.97 R17.1 10.15,72.5 6.5,72.5 5.25,71.25 U1.1
N$57
  Top 0.152: U1.12 6.47,68.03 7.5,67 R18.1
N$58
  Top 0.152: U1.16 7.65,70.25 R16.1
N$61
  Top 0.152: C41.1 74.65,17.65 U11.8
N$62
  Top 0.152: U11.2 79.22,14.38 C42.1
N$66  (via drill 0.6)
  Top 0.406: R10.1 78.79,99.06 D5.A v78.8,101.25
  Bottom 0.406: U4.5 82,89.08 82,91 80.77,92.23 U4.3 80.77,95.73 79.5,97 79.5,97.85 C46.1 C45.1 79.7,100.05 78.8,100.95 v78.8,101.25
N$75
  Top 0.152: LED4.A 51.85,17.75 51.85,19.5 R34.2
NOISE1
  Top 0.406: R9.2 75.5,96 75.97,95.53 D1.P$2 75.7,92.44 U3.3
  Bottom 0.406: U4.2 79.5,93 79,92.5 76.18,92.5 D1.P$2
NOISE2
  Top 0.406: U3.2 75.65,91.17 D4.P$2 75.9,90.87 75.9,88.6 75.3,88 R13.2
  Bottom 0.406: U4.6 80.77,90.23 80,91 76.03,91 D4.P$2
NRF_GPIO  (via drill 0.33)
  Top 0.152: U9.9 58.5,23.5 57.5,24.5 v57.5,25.9 | U6.38 62.5,46.5 64,45 64,44.5 v65.5,43 65.5,39.25 v58.31,31.96 | v37.5,57.5 v35,55 | v44,67.5 v41.5,65 | v75,58.5 75,63 68,70 64,70 61.5,72.5 46,72.5 v42.5,69 | v76,49.25 v76,51.5 | v76.5,47.25 72.25,43 v71.5,43 | v25,53.5 25,55.1 J1.12
  Bottom 0.152: v65.5,43 66.5,44 70.5,44 v71.5,43 | v37.5,57.5 37.75,57.75 37.75,61.5 v41.5,65 | v42.5,69 v44,67.5 | v75,58.5 76,57.5 v76,51.5 | v58.31,31.96 57.83,31.43 57.83,26.23 v57.5,25.9 | v76,49.25 76.5,48.75 v76.5,47.25 | v25,53.5 25,53 26,52 28,52 31,55 v35,55
NRF_INT  (via drill 0.33)
  Top 0.152: U6.67 62.17,60 v64,60 65,61 69,61 70,60 70,42.4 69.3,41.7 68.5,41.7 67.8,41 67.8,38 63.5,33.7 63.5,33 62.92,32.42 62.92,26.77 59.7,23.45 U9.6 | v72.75,70 72.75,70.05 69.25,73.55 J3.3
  Bottom 0.152: v64,60 72.75,68.75 v72.75,70
NRF_LED  (via drill 0.33)
  Top 0.152: U9.19 55.55,17.3 v55.5,17.25 | R34.1 v52,23
  Bottom 0.152: v52,23 52.5,23.5 53.5,23.5 54,23 54,18.75 v55.5,17.25
NRF_PWR_EN  (via drill 0.33)
  Top 0.152: U6.60 64.12,57 65,57 v68,60 | v38.5,52.5 33.5,47.5 33.5,37 32.1,35.6 | v38.5,57.5 v36,55 | v41.5,64 47.75,70.25 60.75,70.25 62.5,68.5 66.5,68.5 v71.5,63.5 | R5.2 32.1,35.6 | 32.1,35.6 29.5,33 v19,33 | v78.8,44.9 79.5,44.2 U18.13 | U18.5 81,39.5 v81.5,39
  Bottom 0.152: J3.7 79.41,71.41 v71.5,63.5 v68,60 68.7,59.3 78.3,59.3 78.8,58.8 v78.8,44.9 78.8,41.7 v81.5,39 | v36,55 v38.5,52.5 | v38.5,57.5 38.5,61 v41.5,64
  Bottom 0.203: U14.4 18.62,33 v19,33
NRF_SWDCLK  (via drill 0.33)
  Top 0.152: U9.24 55.8,15.3 55.5,15 v55.5,14 | TC1.4 45.87,14.23 47.71,14.23 50.94,11 53,11 53.85,11.85 R36.1 53.85,12.15 54,12 v55,12
  Bottom 0.152: v55.5,14 55.5,12.5 v55,12
NRF_SWDIO  (via drill 0.33)
  Top 0.152: U6.46 67.66,47 v68,47 | 53.72,15.7 R35.1 | R35.1 53.7,15.8 | U9.23 55.8,15.7 v55.5,16 R35.1 | v74,21 74,25.5 75.6,27.04 75.6,29.54 76.59,30.59 J6.3 76.86,32.89 v75.75,34 | R35.1 53.85,16.15 53,17 48.19,17 47.69,17.5 46,17.5 45.25,16.75 45.25,15 44.88,14.63 TC1.2
  Bottom 0.152: v68,47 72,47 74,45 74,35.75 v75.75,34 | v55.5,16 56.5,16 61.5,21 v74,21
NRF_TWI_SCL  (via drill 0.33)
  Top 0.152: U9.4 60.5,22.1 64.3,25.9 65.2,25.9 66,26.7 66,34.7 71.3,40 v76.2,40 | v78,37.5 80,39.5 U18.3
  Bottom 0.152: v76.2,40 76.2,38 76.7,37.5 v78,37.5
NRF_TWI_SDA
  Top 0.152: U9.3 60.9,21.8 64.4,25.3 65.3,25.3 66.5,26.5 66.5,34.4 71.4,39.3 74.1,39.3 75.4,38 77.6,38 79.5,39.9 U18.2
RF233_!RST  (via drill 0.33)
  Top 0.152: U2.8 41.82,86.32 41,85.5 41,69.5 v40.8,69.3 | U6.47 67.61,47.75 v68.5,47.75 | v50.25,50.5 56,50.5 v56.5,50 | J6.2 79.4,32.1 v78,33.5
  Bottom 0.152: v50.25,50.5 48.75,50.5 43,56.25 43,65.9 40.8,68.1 v40.8,69.3 | v56.5,50 58.75,47.75 v68.5,47.75 72.25,47.75 74.75,45.25 74.75,36.75 v78,33.5
RF233_CS  (via drill 0.33)
  Top 0.152: v56,81.5 54.5,80 52,80 51.25,80.75 51.25,81.75 U2.23
  Bottom 0.152: U17.10 63.2,82.7 63.5,83 63.5,84.5 63,85 58.5,85 56,82.5 v56,81.5
RF233_IRQ  (via drill 0.33)
  Top 0.152: U2.24 51.75,81.15 v52,80.9 | v39.5,81.5 39,81.5 38.5,81 38.5,73 40,71.5 v40,68.5 | U6.44 67.74,45.5 v68,45.5 | J6.5 71.78,34.03 v72.5,34.75
  Bottom 0.152: v39.5,81.5 51.4,81.5 v52,80.9 | v68,45.5 71.5,45.5 72.5,44.5 v72.5,34.75 | J6.5 71.76,30.59 70.35,32.15 68.9,32.15 56.25,44.75 52.25,44.75 49.75,47.25 47.75,47.25 43.25,51.75 43.25,55 42.25,56 42.25,65.55 40,67.8 v40,68.5
RF233_MISO  (via drill 0.33)
  Top 0.152: v51,80 50.5,80 49.75,80.75 U2.20
  Bottom 0.152: U17.2 57.5,79.5 51.5,79.5 v51,80
RF233_MOSI  (via drill 0.33)
  Top 0.152: U2.22 50.75,81.75 50.75,81.25 v50.5,80.9
  Bottom 0.152: U17.3 58.2,81.7 56.5,80 52,80 51.1,80.9 v50.5,80.9
RF233_PWR_EN  (via drill 0.33)
  Top 0.152: v67,60 64.5,57.5 63.91,57.5 U6.61 63,56.5 60.5,54 60.5,49 57,45.5 57,38 v56.5,37.5 | v63,81.5 59.5,81.5 v58,83
  Bottom 0.152: v67,60 76.5,69.5 76.5,73.39 J3.6 78.1,75 78.1,77.6 76.9,78.8 76.88,78.88 76.88,79.5 74.88,81.5 v63,81.5 | v56.5,37.5 35,37.5 | 35,37.5 30.5,37.5 29,39 29,43.5 28,44.5 27,44.5 26.5,44 19.5,44 18.02,42.52 U15.4 | R6.2 35.62,38.12 35,37.5 | U17.12 62.8,81.7 v63,81.5 | U17.13 62.7,81.2 v63,81.5 | U17.6 58.2,83.2 v58,83 58.3,82.7 U17.5
RF233_SCK  (via drill 0.33)
  Top 0.152: U2.19 49.25,81.75 49.25,80.25 50.5,79 56,79 57,80 57,83.5 59,85.5 61,85.5 v62.5,84
  Bottom 0.152: U17.9 62.5,83.9 v62.5,84
RF233_SLP  (via drill 0.33)
  Top 0.152: 65.5,50.5 U6.48 67.57,48.5 v68,48.5 | U2.11 44.32,84.82 43.6,84 43.6,79.48 43.58,79.53 43.58,73.53 43.6,73.51 43.6,72.6 41.6,70.6 v41.6,68.5 | v49.25,51.25 v56.5,51.25
  Bottom 0.152: v49.25,51.25 48.75,51.25 43.75,56.25 43.75,66.35 v41.6,68.5 | J6.1 81.94,30.81 75.5,37.25 75.5,45.5 72.5,48.5 v68,48.5 59,48.5 v56.5,51.25
SCK  (via drill 0.33)
  Top 0.152: v31.5,63.5 v31.5,56 | U6.11 50,46.41 50,45.5 v48.75,44.25
  Route15 0.152: v61.5,79.5 59.5,81.5 v59.5,84.4
  Bottom 0.152: v48.75,44.25 47.75,44.25 36,56 v31.5,56 21.48,55.9 20.32,54.82 20.33,54.81 J1.13 | v31.5,63.5 31.5,68 30.5,69 30.5,75 34,78.5 60.5,78.5 v61.5,79.5 | v59.5,84.4 59.5,84.5 60.5,84.5 60.75,84.25 U17.8
SENSE_PWR_EN  (via drill 0.33)
  Top 0.152: U6.59 64.33,56.5 65.5,56.5 v69,60 | v42.5,52.5 42,52 39,52 34.25,47.25 v34.25,42.5 | v41.5,61 48.5,68 66,68 v71.5,62.5 | v30.5,39 27,35.5 v19.4,35.5 | v79.6,46.3 79.5,46.2 79.5,45 80,44.5 U18.12 | U18.6 82.5,39.7 v82.5,39.5
  Bottom 0.152: J3.8 81.95,72.95 v71.5,62.5 v69,60 78.6,60 79.6,59 v79.6,46.3 79.5,46.2 79.5,45 80,44.5 80,41.5 82,39.5 v82.5,39.5 | v42.5,52.5 42.5,55 41.5,56 v41.5,61 | v30.5,39 30.5,39.1 33.9,42.5 v34.25,42.5 34,42.25 R4.2 | v19.4,35.5 19,35.5 18.77,35.73 U13.4
SENSE_TWI_SCL  (via drill 0.33)
  Top 0.152: 77.38,19.25 U10.5 77.44,19.25 79,19.25 79.5,18.75 v79.5,17.75 | U11.4 79.14,15.38 79.5,15.75 v79.5,17.75 | U8.6 77.75,20.78 v77.75,20.75 | v79.5,17.75 79.75,18 84.5,18 85,18.5 85,44.5 84.5,45 81.5,45 81,44.5 U18.10
  Bottom 0.152: v77.75,20.75 77.75,18.25 78.25,17.75 v79.5,17.75
SENSE_TWI_SDA
  Top 0.152: U11.6 77.14,17.11 76.75,17.5 76.75,19.5 77,19.75 77.38,19.75 U10.6 77.44,19.75 78.75,19.75 79.69,20.7 U8.1 79.93,21.5 83.5,21.5 84.5,22.5 84.5,44 84,44.5 82,44.5 81.5,44 U18.9
SPI_NCS0  (via drill 0.33)
  Top 0.152: v42.25,48.5 47.14,48.5 U6.4 | v29,48.5 26.5,51 26.5,59.5 25,61 21.54,61 20.33,62.21 J1.7
  Bottom 0.152: v42.25,48.5 v29,48.5
SPI_NCS1  (via drill 0.33)
  Top 0.152: U6.3 48.16,50.16 47.25,49.25 v41.5,49.25 | v30,49.5 29.75,49.5 27.25,52 27.25,61.25 25,63.5 21.5,63.5 20.32,64.68 20.33,64.69 J1.5
  Bottom 0.152: v30,49.5 30.25,49.25 v41.5,49.25
SPI_NCS2  (via drill 0.33)
  Top 0.152: U6.1 47.25,50.75 v40,50.75 | v34.75,54 33.5,55.25 33.5,65 29.9,68.7 21.4,68.7 20.32,69.68 20.33,69.69 J1.1
  Bottom 0.152: v40,50.75 38,50.75 v34.75,54
SPI_NCS3  (via drill 0.33)
  Top 0.152: v31,50.5 30.5,50.5 28,53 28,60.5 28.4,60.9 v28.4,61 28.4,62.1 28,62.5 24.7,66.1 21.6,66.1 20.32,67.18 20.33,67.19 J1.3 | U6.2 47.22,50 v40.75,50
  Bottom 0.152: v40.75,50 32,50 31.5,50.5 v31,50.5 | U17.11 63.2,82.2 64,83 64,85 63.6,85.4 58,85.4 54.1,81.5 53,81.5 52,82.5 35.5,82.5 34,84 32,84 28,80 28,61.4 v28.4,61
SWDCLK/TCK
  Top 0.152: U6.18 52.8,44.26 52.8,38.3 51.25,36.75 47.75,36.75 45.75,34.75 35.15,34.75 30.2,29.8 30.2,26.8 33.5,23.5 37.5,23.5 39.7,21.3 42.6,21.3 43.55,22.25 TC2.4
SWDIO/TMS  (via drill 0.33)
  Top 0.152: U6.19 53.2,43.96 53.2,37.5 51.9,36.2 48.33,36.2 v47.57,35.44 | v38,21 38,19.7 39.7,18 42.5,18 43.3,18.7 43.3,20.66 TC2.2
  Bottom 0.152: v47.57,35.44 44.74,32.61 42.61,32.61 38,28 v38,21
TRNG_EN  (via drill 0.33, 0.6)
  Top 0.203: U6.63 63,58 64,58 v66,60 | J3.5 74.33,74.33 75,75 80.2,75 80.7,75.5 80.7,77.7 82.5,79.5 v83.5,79.5
  Top 0.406: SJ6.1 80.3,81.15 R30.2 85,80 84.5,79.5 v83.5,79.5
  Bottom 0.203: v66,60 74.5,68.5 74.5,73.59 J3.5
  Bottom 0.406: U12.4 83,81.15 83,80 v83.5,79.5
TRNG_OUT  (via drill 0.33)
  Top 0.203: v65,60 63.5,58.5 62.79,58.5 U6.64 | J3.4 70.5,75.05 70.5,89 71.41,89.91 U3.1
  Top 0.406: U3.1
  Bottom 0.203: v65,60 73.5,68.5 73.5,72.05 J3.4
TRNG_PWR_EN  (via drill 0.33)
  Top 0.152: U6.62 57.71,52 47.5,52 47,51.5 39.5,51.5 v35,47 | 32,44 v32,45.3 | R7.2 32,44 | 32,44 30,44 v26.6,40.6
  Bottom 0.152: v32,45.3 33.5,47 v35,47 | v26.6,40.6 19.32,40.6 U16.4
TWI1_SCL  (via drill 0.33)
  Top 0.152: 27,73 v24.75,73 | R2.1 27.99,73.99 27,73 | v55.75,45.5 55.75,45.09 U6.21 | 27,73 36.49,73 J2.1 37.24,73.77 J2_3_5_AND_6.SCL
  Bottom 0.152: v24.75,73 24.75,68.5 23.55,67.3 22.96,67.3 J1.4 | v55.75,45.5 55.75,45.75 51.5,50 51.5,50.25 49.75,52 49.5,52 45.25,56.25 45.25,68.25 41.7,71.8 39.21,71.8 J2.1
TWI1_SDA  (via drill 0.33)
  Top 0.152: v31.75,69.75 22.95,69.75 22.87,69.83 J1.2 22.77,69.93 22.36,70.34 22.36,72.86 24,74.5 25.89,74.5 R1.1 | v54.4,48.05 54.5,47.95 54.5,46.65 54.95,46.2 54.95,45 U6.20 54.17,44.27
  Bottom 0.152: v54.4,48.05 46,56.5 46,68.5 42,72.5 41,72.5 39.79,73.71 J2.2 39.78,73.77 J2_3_5_AND_6.SDA 39.78,76.28 38.5,75 36,75 35.5,74.5 35.5,73.5 v31.75,69.75
TWI2_SCL  (via drill 0.33)
  Top 0.152: v49.75,60.75 49.5,60.5 49.5,56.67 U6.92 50.8,55.37 50.8,53.7 v51.7,52.8 | v70.1,32.8 71,33.7 71,36 71.5,36.5 79,36.5 v80.5,38 U18.4 | U18.11 80.5,45.1 v80.3,45.3
  Bottom 0.152: J2.7 49.75,71.02 v49.75,60.75 49.75,62.15 R25.1 | v51.7,52.8 56.6,47.9 56.6,45.3 60.5,41.4 60.5,41.2 62.3,39.4 63.1,39.4 69.7,32.8 v70.1,32.8 | v80.3,45.3 83.2,45.3 84.5,44 84.5,40.5 82,38 v80.5,38
TWI2_SDA  (via drill 0.33)
  Top 0.152: v50.75,60.75 50,60 50,56.88 U6.91 51.5,55.38 v51.5,54 | v71.75,35.75 v78.23,35.75 | v77.4,39.4 77.4,40.9 78.25,41.75 U18.1 | v83,37.5 84,38.5 84,42 83.75,42.25 U18.8
  Bottom 0.152: v51.5,54 57.25,48.25 57.25,45.75 59.75,43.25 62.75,43.25 64.25,41.75 | 64.25,41.75 70.3,35.7 71.7,35.7 v71.75,35.75 | v50.75,60.75 56.25,66.25 56.25,71.75 55,73 55,73.73 J2.8 | R38.1 64.25,41.75 | 79.1,37.1 82.6,37.1 v83,37.5 | 79.1,37.1 79.1,36.4 78.45,35.75 v78.23,35.75 | v77.4,39.4 79.1,37.7 79.1,37.1
USART0_CLK  (via drill 0.33)
  Top 0.152: U6.90 52,55.59 52,54.5 v53.5,53 | v71.5,51.75 74.25,54.5 81,54.5 82.08,53.42 J2_3_5_AND_6.SCK
  Bottom 0.152: v71.5,51.75 71.25,51.5 57.5,51.5 57,52 54.5,52 v53.5,53 51.75,54.75 49.5,54.75 47.5,56.75 47.5,70.8 46.2,72.1 46.2,75.1 J2_3_5_AND_6.D13
USART0_CTS  (via drill 0.33)
  Top 0.152: U6.75 58.75,62.23 v58.75,63.25
  Bottom 0.152: J2_3_5_AND_6.D9 57.7,76.3 58.75,75.25 v58.75,63.25
USART0_RTS  (via drill 0.33)
  Top 0.152: v51.75,60.75 50.84,59.84 50.84,57.45 U6.89
  Bottom 0.152: J2_3_5_AND_6.D10 56.25,75.07 56.25,73 56.75,72.5 56.75,65.75 v51.75,60.75
USART0_RX  (via drill 0.33)
  Top 0.152: U6.93 49,56.46 49,60 v48.25,60.75 | J2_3_5_AND_6.MISO 81.65,55.5 72.45,55.5 71.5,56.45 71.5,60.5 65.5,66.5 52.5,66.5 49.25,63.25 v48.25,63.25
  Bottom 0.152: v48.25,60.75 v48.25,63.25 48.25,72.92 J2.5 49.94,76.29 J2_3_5_AND_6.D12
USART0_TX  (via drill 0.33)
  Top 0.152: U6.94 48.5,56.26 48.5,59.5 v48.25,59.75 | J2_3_5_AND_6.MOSI 83.35,54.73 83.35,56.73 82.5,57.5 73,57.5 72.25,58.25 72.25,60.75 65.75,67.25 52.25,67.25 v49,64
  Bottom 0.152: v48.25,59.75 49,60.5 v49,64 49,72.81 J2.6 49.95,73.77 J2_3_5_AND_6.D11
USART2_CLK  (via drill 0.33)
  Top 0.152: U6.76 54.98,62.5 v55,62.5 | U9.5 60.1,22.6 64,26.5 65,26.5 65.5,26.95 65.5,34.9 68.3,37.8 68.3,40.7 68.8,41.2 69.5,41.2 70.75,42.45 70.75,60.25 65.25,65.75 v57.5,65.75
  Bottom 0.152: v55,62.5 55,63.25 v57.5,65.75 57.57,65.82 J2.9
USART2_CTS
  Top 0.152: U6.37 63.5,44.79 63.5,38 56.75,31.25 56.75,30.75 56.59,30.59 J5.4 56.54,30.54 55.27,29.3 55.27,25.55 58.1,22.65 U9.10
USART2_RTS
  Top 0.152: U6.36 63,44.59 63,38.25 56.75,32 55,32 54,31 J5.5 52.71,29.34 52.71,26.75 57.7,21.8 U9.11
USART2_RX
  Top 0.152: J5.3 | U6.40 66.25,44.16 66.25,39.25 59.08,32.08 J5.3 | U9.8 58.9,25.85 57.82,27 57.82,29.26 J5.3
USART2_TX
  Top 0.152: U6.41 66.75,44.37 66.75,38.75 61.75,33.75 61.75,30.72 J5.2 60.37,29.29 60.37,26.82 59.3,25.8 U9.7
USART3_RTS  (via drill 0.33)
  Top 0.152: U6.45 67.7,46.25 v68.5,46.25 | v74,58.5 74,63 67.5,69.5 63.5,69.5 61.25,71.75 46.25,71.75 42,67.5 39.2,67.5 v39.15,67.55 | v75,53.5 73,51.5 73,47 v72,46 | v32.25,54 v32.25,64.5 | J6.4 74.32,30.93 72.75,32.5 v72.75,33.5
  Bottom 0.152: v68.5,46.25 71.75,46.25 v72,46 73.25,44.75 73.25,34 v72.75,33.5 | v74,58.5 75,57.5 v75,53.5 | v32.25,54 32.25,53.25 27.35,48.35 16.55,48.35 15.4,49.5 U7.19 | v32.25,64.5 32.25,65.75 34,67.5 39.1,67.5 v39.15,67.55
USART3_RX  (via drill 0.33)
  Top 0.152: U6.73 61,63.07 v61,64 | v39.5,60 48.25,68.75 v61,68.75 | v39.5,57.5 34.5,52.5 v30.25,52.5 | J2_3_5_AND_6.D0 82.7,76.3 84,75 84,71.5 81.5,69 70.9,69 68.6,71.3 65.3,71.3 v65.25,71.25 65.25,72.68 J3.1
  Bottom 0.152: v61,64 v61,68.75 61,70 62.25,71.25 v65.25,71.25 | v39.5,60 v39.5,57.5 | v30.25,52.5 28.51,50.89 19.36,50.89 19,50.5 18.8,50.3 17.7,50.3 17.5,50.5 U7.17
USART3_TX  (via drill 0.33)
  Top 0.152: U6.74 59.5,62.28 v59.5,64 | v40.5,57.5 30.5,47.5 25.2,47.5 24.4,48.3 24.4,52.9 23.9,53.4 16.4,53.4 16,53 16,47.8 v14.5,46.3 | v40.5,62 48,69.5 v59.5,69.5 | J2.10 60.26,73.76 61.5,75 61.5,76.5 v65,80 | J2_3_5_AND_6.D1 75.7,80 v75.5,80
  Bottom 0.152: v59.5,64 v59.5,69.5 59.5,73 60.12,73.62 60.11,73.63 J2.10 | v40.5,57.5 v40.5,62 | v75.5,80 v65,80 | U7.1 13,46.7 13.4,46.3 v14.5,46.3
USB_N
  Top 0.152: U6.98 47.78,54.15 40.5,54.15 arc48 36.1,52.2 arc-5 31.2,47.2 arc-34 27.25,45.25 20,44.5 arc81 15.5,40 arc-88 10.75,35.75 10.6,35.75 arc-90 R28.2
USB_P
  Top 0.152: R29.2 arc-35 11,35.35 arc86 16,40 arc-81 19.75,44 arc0 27.9,44.9 arc42 31.6,46.8 36.4,51.7 arc-55 40.5,53.85 47.37,53.85 U6.99
USER_BTN  (via drill 0.33)
  Top 0.152: U6.79 53.86,61.5 47.5,61.5 44.5,58.5 v34.5,58.5 | v18.5,58.5 22,58.5 22.87,59.37 J1.10 | R3.1 30,77 24.61,82.39 SW2.3 SW2.4 19,82.66 19,82 15.5,78.5 v15.5,61.25
  Bottom 0.152: v34.5,58.5 29.48,58.52 25.53,58.52 24.38,59.67 22.87,59.67 J1.10 | v15.5,61.25 18.25,58.5 v18.5,58.5
USER_LED  (via drill 0.33)
  Top 0.152: U6.39 65,44.71 v65,44.5 | v71.5,44.5 75,48 | 75,48 R24.1 | v73,58.5 73,63 67,69 63,69 61,71 46.5,71 42,66.5 38.5,66.5 33,72 27,72 v26.5,71.5 | v74,51.5 74,49 75,48
  Bottom 0.152: v65,44.5 v71.5,44.5 | v73,58.5 74,57.5 v74,51.5 | J1.8 23.06,62.5 25,62.5 27,64 27,71 v26.5,71.5
VCC_3V3  (via drill 0.33, 0.6)
  Top 0.406: R21.1 7.92,58.75 8.5,58.17 8.5,56.8 v11,54.3 | U5.5 11.98,58.27 C16.1 11,57.15 v11,54.3 | C17.1 v11,54.3 | v38.4,30.1 35.4,27.1 v32.5,27.1
  Route15 0.152: J2_3_5_AND_6.3.3V 53.96,28.04 | 50.2,29.25 50.13,29.25
  Route15 0.406: 11,50.72 v11,54.3
  Bottom 0.152: v11,54.3 11,52.9 | 11,52.9 U7.11 | U7.20 14.1,49 v14.8,48.3 | U7.12 11.5,52.4 11,52.9 | 17.43,42.5 U15.3 17.02,42.52 17,42.5 | U16.3 16.68,39.33 arc-90 16.5,39.5 | 17,32.5 17.18,32.33 U14.3 | U13.3 17.45,36.5 17.5,36.5
  Bottom 0.203: J4.3.1 21.64,35.5 26,35.5 26.4,35.9 SJ4.1
  Bottom 0.406: v16.5,36.5 16.5,33 17,32.5 | v16.5,36.5 16.5,39.5 16.5,42 17,42.5 | J4.3.1 20,36.5 17.5,36.5 v16.5,36.5
  pour Route15 (isolate 0.305): 0,12 37.5,12 37.4,31.4 18.4,31.4 18.5,86.5 0,86.5
  pour Route15: 36.84,31.52 36.84,27.02 55,27 55,31.5
VCC_BAT
  Top 0.152: U1.3 4.25,71.75 4.5,72 4.75,71.75 U1.2
  Top 0.406: BAT1.PWR@1 8.63,82.13 4.5,78 4.5,72
VCC_DBG_USB_5V
  Top 0.406: USB2.VBUS 5.62,51.12 6.7,52.2 D2.A
VCC_EXT_5V  (via drill 0.6)
  Top 0.406: v47.5,26 45.27,26 43.2,28.06 D9.A
  Route15 0.406: v47.5,26 54.5,26 J2_3_5_AND_6.5V 58.58,26 62,26 64.04,28.04 J2_3_5_AND_6.VIN 66,29.88 66,39.5 67.9,41.4 73.9,41.4 78.5,46 78.5,56.5 80,58 83.5,58 84.62,56.88 J2_3_5_AND_6.VCC
VCC_IN  (via drill 0.33, 0.6)
  Top 0.152: U1.13 8.45,68.75 | U1.6 v1.2,69.75
  Top 0.406: D2.C 9.13,53.5 | D2.C 9.13,53.63 | D2.C 8.16,53.63 6.5,55.29 v6.5,55.5 | D9.C 36.23,25.1 v34,25.1 | 8.45,68.75 11.65,68.75 C14.1 11.65,67 v11.5,66.8 | v6.5,41 8.5,41 9.51,40 D3.C
  Route15 0.406: v34,25.1 22.4,25.1 v6.5,41 v6.5,55.5 11.5,60.5 v11.5,66.8
  Bottom 0.152: v1.2,69.75 0.7,69.2 0.7,68.4 1.1,68 10.1,68 11.25,66.8 v11.5,66.8
VCC_LDO
  Top 0.152: U1.11 4.75,66.5 | 4.75,66.5 4.75,65.6 7.35,63 R20.1 | U1.10 4.25,67 4.75,66.5
  Top 0.406: U5.1 11.98,63.52 11.5,64 | 11.5,64 10.5,64 10,63.5 10,62.79 U5.3 9.79,63 9,62.21 9,61.5 8.5,61 R20.1 | 11.5,64 11.5,64.5 12.5,65.5 13.15,65.5 C8.1
VCC_MCU_3V3  (via drill 0.33, 0.6)
  Top 0.152: R2.2 28.31,76.34 | C22.2 48,45.19 48,46.5 49.93,48.43 | 49.93,48.43 50.8,49.3 v51,49.3 | 49.93,48.43 U6.8 | C19.2 44.5,56.01 v44.5,57.3 | U6.97 47.14,55.5 | U6.57 64.43,55.18 63.5,54.25 v62.75,54.25 | L1.2 68.15,57.9 v67.25,57 | R26.2 42.6,39.1 v41.7,39.1 | R33.2 v29.32,19.82 31.65,17.5 44,17.5 45.2,18.7 45.2,20.5 44.88,20.82 TC2.1 | U6.17 53.73,45.9 v54.2,45.9 | U6.87 51.6,58.11 51.6,59.1 | v52.5,60 51.6,59.1 | 51.6,59.1 51.3,58.8 51.3,57.7 U6.88 | v76.3,45.8 76.3,44.2 78.25,42.25 U18.14
  Top 0.406: R1.2 R2.2 | 28.31,76.34 R3.2 C18.2 33.65,74.65 v34.6,75.6 | C21.1 37.94,47.44 v39.37,47.44 | 47.14,55.5 44,55.5
  Route15 0.152: v50.5,67 55.5,72 62,72 62.5,72.5 v62.5,80.5
  Route15 0.406: J4.3.2 33.48,36.82 33.5,36.8
  Bottom 0.152: R25.2 50.75,66.75 v50.5,67 | C15.2 52.93,59.57 v52.5,60 | C50.2 59.35,55.1 v58.25,54 | R38.2 67.6,42.6 v68,43 | U17.14 60.9,80.5 v62.5,80.5 | 27.5,38 26.3,38 25.38,37.08 SJ4.2
  Bottom 0.203: SJ4.2 25.24,36.82 J4.3.2
  Bottom 0.406: v29.32,19.82 29.27,19.82 26,23.1 26,28.5 28,30.5 28,37.5 27.5,38
  pour Route15 (isolate 0.305): 31.75,55.55 31.7,76.8 87,77 87,58.75 87.05,53.55 87.1,53.5 87.1,32.3 81.55,32.35 78.65,32.35 68.75,32.25 50.5,32.25 31.75,32.35 31.75,40.25 31.8,46.6 31.75,50.5
VCC_NRF_3V3  (via drill 0.6)
  Top 0.152: U9.1 61.7,20.7 62.5,21.5 | TC1.1 43.42,14.52 43.1,14.2 40.3,14.2 39.6,13.5 39.6,13.3 | U9.12 56.1,20.4 | 56.1,20.4 55.9,20.4 55.25,19.75 | 56.1,20.4 v55.5,21 | U9.35 61.3,14.11 61.7,13.71 U9.36
  Top 0.406: R35.2 51,16 v50,15 50,13 51,12 R36.2 | 55.25,19.75 54.1,19.75 C31.1 | 61.7,13.71 C38.1 62.65,13 63.5,13 v64.25,13.75 | C32.1 66.22,23.22 C33.1 65.25,22.25 v64.5,22.25 63.75,21.5 62.5,21.5 | 39.6,13.3 39.6,11.9 39.6,11.2 40.3,10.5 v40.5,10.5
  Route15 0.406: J4.5.2 32.24,31.76 39,25
  Bottom 0.152: J4.5.2 22.86,31.74
  Bottom 0.203: SJ2.2 J4.5.2
  pour Route15 (isolate 0.305): 38.25,26 38.25,8.5 70.25,8.5 70.15,26.2 40.5,26.3
VCC_RF233_3V3  (via drill 0.33)
  Top 0.152: U2.28 52.82,83.82 v55,86 C5.1 | C13.1 v46.6,83.25 47.03,82.82 U2.15
  Bottom 0.203: SJ3.2 23.09,42.11 J4.1.2
  pour Route15 (isolate 0.305): 61,77.75 61,95.2 35.5,95 35.5,88 19.25,88 19.25,40.5 30.7,40.6 30.5,76.4 31.1,77.4 31.55,77.7 45.05,77.7 47,77.75
VCC_SENSE_3V3  (via drill 0.33, 0.6)
  Top 0.152: U10.1 76.06,20.69 v74.75,22 | U11.1 78,13.8 v78,11.25 | U11.14 76.1,13.57 v76.1,11.3
  Top 0.406: U8.5 U8.4 76.75,23.78 76.75,24.25 77.25,24.75 79.25,24.75 79.69,24.3 U8.3 81.23,23.73 v81.25,23.75
  Route15 0.406: J4.4.2 24.6,32.5 32.9,32.5 38.55,26.85 45.15,26.85 47.4,24.6 68.9,24.6 71.5,22 v74.75,22
  Bottom 0.152: J4.4.2 22.86,34.24 | v74.75,22 75,21.75 R37.2 76.75,20.9 C40.1 76.75,19.25 | C43.1 75.1,11.3 v76.1,11.3
  Bottom 0.203: SJ1.1 25.35,34.22 J4.4.2
  Bottom 0.406: C29.1 77.85,23.75 v81.25,23.75
  pour Route15 (isolate 0.305): 71,26.75 86.5,26.75 86.5,8.5 71,8.5
VCC_TARGET_USB_5V
  Top 0.406: USB1.VBUS 5.85,37.05 7.2,38.4 D3.A
VCC_TRNG_3V3  (via drill 0.6)
  Top 0.406: 78.6,82.05 SJ6.2 78.55,79.95 79,79.5 v80.5,79.5 | v79.5,86 78.5,85 78.5,84.6 L3.2 78.6,82.05 | U3.8 67.28,89.47 C44.1 66.5,87.23 v66.5,85.5 | 78.6,82.05 76.55,82.05 v76.5,82 | v27.5,43.2 23.64,39.34 J4.2.2
  Route15 0.406: v27.5,43.2 27.5,76.5 28.75,77.75 50.45,77.75 58.2,85.5 v66.5,85.5 66.5,83.5 68,82 v76.5,82
  Bottom 0.152: J4.2.2
  Bottom 0.203: SJ7.2 25.15,39.34 J4.2.2
  Bottom 0.406: C48.1 80.5,87 v79.5,86 | U12.5 81,81.15 81,80 v80.5,79.5
VHIGH  (via drill 0.6)
  Top 0.406: R10.2 R11.2 R14.2 C11.1 79.15,90.15 76,87 | D6.C 85,84.58 85,87 v84.5,87.5 | v77.5,87 76,87 | C49.+ 74.4,85.4 76,87
  Route15 0.406: v84.5,87.5 78,87.5 v77.5,87
  Bottom 0.406: C7.1 76.31,89.05 U4.8 78.23,87.73 v77.5,87 | C47.1 85.35,86.65 v84.5,87.5
VHIGHSAMPLE  (via drill 0.33)
  Top 0.152: U6.29 60.39,42.25 v60.75,42.25 | v64.1,43.5 64.42,43.17 v64.42,40.58 | v60.45,47.15 65.5,52.2 66.75,52.2 67.05,52.5 v67.4,52.5 | v77.6,58.45 77.6,63.7 86.45,72.55 86.45,91.55 v85.5,92.5 | R12.2 83,94.7 v83.95,93.75 | v77.6,56.9 77.2,56.5 v72.9,56.5
  Top 0.406: R11.1 82.85,94.9 R12.2
  Bottom 0.152: v60.75,42.25 62.75,42.25 v64.42,40.58 | v60.45,47.15 v64.1,43.5 | v77.6,56.9 v77.6,58.45 | v83.95,93.75 85.2,92.5 v85.5,92.5 | v67.4,52.5 68.9,52.5 v72.9,56.5